# Altium project OBC Development Board.PrjPcb
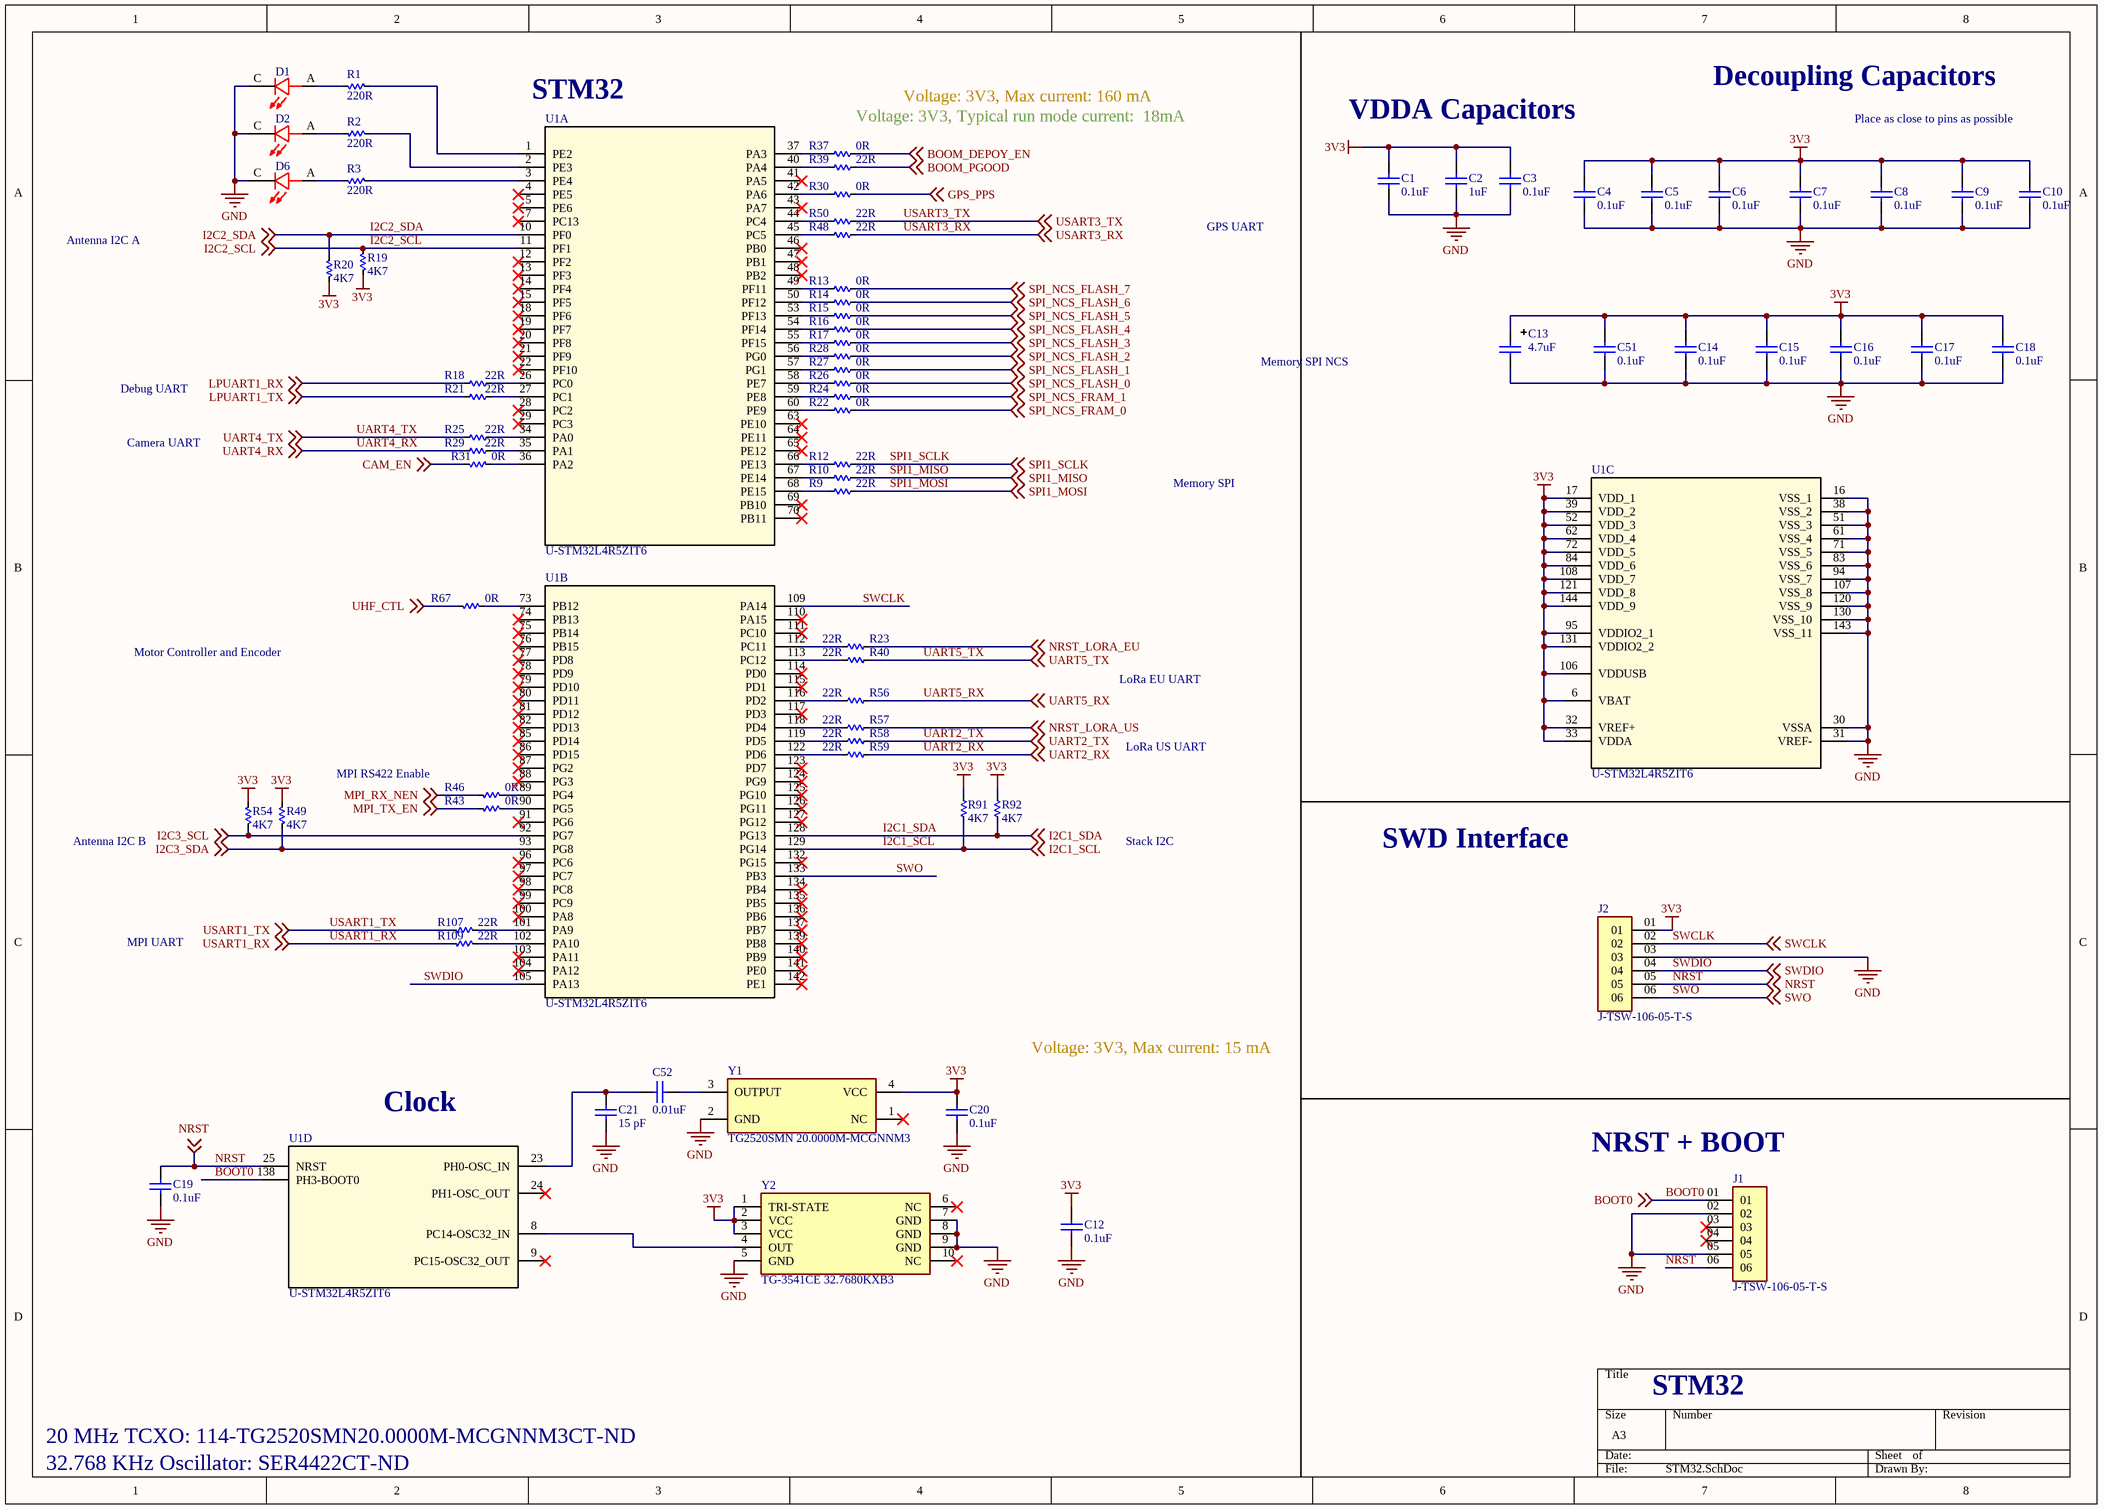
[diagram p0: STM32.SchDoc]
5 sheets, 189 parts. Net scope: global (net labels, ports and power ports of the same name join across sheets).
Board file: OBC Development Board.PcbDoc
Sheets:
  STM32.SchDoc
  Memory.SchDoc
  External Connectors.SchDoc
  Antenna and LoRa.SchDoc
  Boom Deployment.SchDoc

## Sheet STM32.SchDoc
size A3; SheetNumber: 1; SheetTotal: 5

### Parts
C1  0.1uF  [0603]
C2  1uF  [0603]
C3  0.1uF  [0603]
C4  0.1uF  [0603]
C5  0.1uF  [0603]
C6  0.1uF  [0603]
C7  0.1uF  [0603]
C8  0.1uF  [0603]
C9  0.1uF  [0603]
C10  0.1uF  [0603]
C12  0.1uF  [0402]
C13  4.7uF  [CAP TANT 1206 (A) TCJ]
C14  0.1uF  [0603]
C15  0.1uF  [0603]
C16  0.1uF  [0603]
C17  0.1uF  [0603]
C18  0.1uF  [0603]
C19  0.1uF  [0603]
C20  0.1uF  [0402]
C21  15 pF  [0402]
C51  0.1uF  [0603]
C52  0.01uF  [0603]
D1  D-SML-D12U1WT86  [D-SML-D12U1WT86]  (value not drawn)
D2  D-SML-D12U1WT86  [D-SML-D12U1WT86]  (value not drawn)
D6  D-SML-D12U1WT86  [D-SML-D12U1WT86]  (value not drawn)
J1  J-TSW-106-05-T-S  [J-TSW-106-05-T-S]
J2  J-TSW-106-05-T-S  [J-TSW-106-05-T-S]
R1  220R  [0603]
R2  220R  [0603]
R3  220R  [0603]
R9  22R  [0603]
R10  22R  [0603]
R12  22R  [0603]
R13  0R  [0603]
R14  0R  [0603]
R15  0R  [0603]
R16  0R  [0603]
R17  0R  [0603]
R18  22R  [0603]
R19  4K7  [0603]
R20  4K7  [0603]
R21  22R  [0603]
R22  0R  [0603]
R23  22R  [0603]
R24  0R  [0603]
R25  22R  [0603]
R26  0R  [0603]
R27  0R  [0603]
R28  0R  [0603]
R29  22R  [0603]
R30  0R  [0603]
R31  0R  [0603]
R37  0R  [0603]
R39  22R  [0603]
R40  22R  [0603]
R43  0R  [0603]
R46  0R  [0603]
R48  22R  [0603]
R49  4K7  [0603]
R50  22R  [0603]
R54  4K7  [0603]
R56  22R  [0603]
R57  22R  [0603]
R58  22R  [0603]
R59  22R  [0603]
R67  0R  [0603]
R91  4K7  [0603]
R92  4K7  [0603]
R107  22R  [0603]
R109  22R  [0603]
U1  U-STM32L4R5ZIT6  [U-STM32L4R5ZIT6]  (parts A,B,C,D of 4)
Y1  TG2520SMN 20.0000M-MCGNNM3  [Y-TG2520SMN 20.0000M-MCGNNM3]
Y2  TG-3541CE 32.7680KXB3  [Y-TG-3541CE 32.7680KXB3]

### Nets
3V3: C1.2 C2.2 C3.2 C4.2 C5.2 C6.2 C7.2 C8.2 C9.2 C10.2 C12.2 C13.1 C14.2 C15.2 C16.2 C17.2 C18.2 C20.2 C51.2 J2.01 R19.1 R20.1 R49.1 R54.1 R91.2 R92.1 U1.6(VBAT) U1.17(VDD_1) U1.32(VREF+) U1.33(VDDA) U1.39(VDD_2) U1.52(VDD_3) U1.62(VDD_4) U1.72(VDD_5) U1.84(VDD_6) U1.95(VDDIO2_1) U1.106(VDDUSB) U1.108(VDD_7) U1.121(VDD_8) U1.131(VDDIO2_2) U1.144(VDD_9) Y1.4(VCC) Y2.1(TRI-STATE) Y2.2(VCC) Y2.3(VCC)
GND: C1.1 C2.1 C3.1 C4.1 C5.1 C6.1 C7.1 C8.1 C9.1 C10.1 C12.1 C13.2 C14.1 C15.1 C16.1 C17.1 C18.1 C19.1 C20.1 C21.2 C51.1 D1.C D2.C D6.C J1.02 J1.05 J2.03 U1.16(VSS_1) U1.30(VSSA) U1.31(VREF-) U1.38(VSS_2) U1.51(VSS_3) U1.61(VSS_4) U1.71(VSS_5) U1.83(VSS_6) U1.94(VSS_7) U1.107(VSS_8) U1.120(VSS_9) U1.130(VSS_10) U1.143(VSS_11) Y1.2(GND) Y2.5(GND) Y2.7(GND) Y2.8(GND) Y2.9(GND)
BOOM_DEPOY_EN: R37.2 ; off-sheet BOOM_DEPOY_EN
BOOM_PGOOD: R39.1 ; off-sheet BOOM_PGOOD
BOOT0: J1.01 U1.138(PH3-BOOT0) ; off-sheet BOOT0
CAM_EN: R31.1 ; off-sheet CAM_EN
GPS_PPS: R30.2 ; off-sheet GPS_PPS
I2C1_SCL: R91.1 U1.129(PG14) ; off-sheet I2C1_SCL
I2C1_SDA: R92.2 U1.128(PG13) ; off-sheet I2C1_SDA
I2C2_SCL: R19.2 U1.11(PF1) ; off-sheet I2C2_SCL
I2C2_SDA: R20.2 U1.10(PF0) ; off-sheet I2C2_SDA
I2C3_SCL: R54.2 U1.92(PG7) ; off-sheet I2C3_SCL
I2C3_SDA: R49.2 U1.93(PG8) ; off-sheet I2C3_SDA
LPUART1_RX: R18.1 ; off-sheet LPUART1_RX
LPUART1_TX: R21.1 ; off-sheet LPUART1_TX
MPI_RX_NEN: R46.2 ; off-sheet MPI_RX_NEN
MPI_TX_EN: R43.2 ; off-sheet MPI_TX_EN
NRST: C19.2 J1.06 J2.05 U1.25(NRST) ; off-sheet NRST
NRST_LORA_EU: R23.2 ; off-sheet NRST_LORA_EU
NRST_LORA_US: R57.2 ; off-sheet NRST_LORA_US
SPI1_MISO: R10.1 ; off-sheet SPI1_MISO
SPI1_MOSI: R9.1 ; off-sheet SPI1_MOSI
SPI1_SCLK: R12.1 ; off-sheet SPI1_SCLK
SPI_NCS_FLASH_0: R26.2 ; off-sheet SPI_NCS_FLASH_0
SPI_NCS_FLASH_1: R27.2 ; off-sheet SPI_NCS_FLASH_1
SPI_NCS_FLASH_2: R28.2 ; off-sheet SPI_NCS_FLASH_2
SPI_NCS_FLASH_3: R17.2 ; off-sheet SPI_NCS_FLASH_3
SPI_NCS_FLASH_4: R16.2 ; off-sheet SPI_NCS_FLASH_4
SPI_NCS_FLASH_5: R15.2 ; off-sheet SPI_NCS_FLASH_5
SPI_NCS_FLASH_6: R14.2 ; off-sheet SPI_NCS_FLASH_6
SPI_NCS_FLASH_7: R13.2 ; off-sheet SPI_NCS_FLASH_7
SPI_NCS_FRAM_0: R22.2 ; off-sheet SPI_NCS_FRAM_0
SPI_NCS_FRAM_1: R24.2 ; off-sheet SPI_NCS_FRAM_1
SWCLK: J2.02 U1.109(PA14) ; off-sheet SWCLK
SWDIO: J2.04 U1.105(PA13) ; off-sheet SWDIO
SWO: J2.06 U1.133(PB3) ; off-sheet SWO
UART2_RX: R59.2 ; off-sheet UART2_RX
UART2_TX: R58.2 ; off-sheet UART2_TX
UART4_RX: R29.1 ; off-sheet UART4_RX
UART4_TX: R25.1 ; off-sheet UART4_TX
UART5_RX: R56.2 ; off-sheet UART5_RX
UART5_TX: R40.2 ; off-sheet UART5_TX
UHF_CTL: R67.1 ; off-sheet UHF_CTL
USART1_RX: R109.2 ; off-sheet USART1_RX
USART1_TX: R107.2 ; off-sheet USART1_TX
USART3_RX: R48.1 ; off-sheet USART3_RX
USART3_TX: R50.1 ; off-sheet USART3_TX
NetC21_1: C21.1 C52.1 U1.23(PH0-OSC_IN)
NetC52_2: C52.2 Y1.3(OUTPUT)
NetD1_A: D1.A R1.1
NetD2_A: D2.A R2.1
NetD6_A: D6.A R3.1
NetR1_2: R1.2 U1.1(PE2)
NetR2_2: R2.2 U1.2(PE3)
NetR3_2: R3.2 U1.3(PE4)
NetR9_2: R9.2 U1.68(PE15)
NetR10_2: R10.2 U1.67(PE14)
NetR12_2: R12.2 U1.66(PE13)
NetR13_1: R13.1 U1.49(PF11)
NetR14_1: R14.1 U1.50(PF12)
NetR15_1: R15.1 U1.53(PF13)
NetR16_1: R16.1 U1.54(PF14)
NetR17_1: R17.1 U1.55(PF15)
NetR18_2: R18.2 U1.26(PC0)
NetR21_2: R21.2 U1.27(PC1)
NetR22_1: R22.1 U1.60(PE9)
NetR23_1: R23.1 U1.112(PC11)
NetR24_1: R24.1 U1.59(PE8)
NetR25_2: R25.2 U1.34(PA0)
NetR26_1: R26.1 U1.58(PE7)
NetR27_1: R27.1 U1.57(PG1)
NetR28_1: R28.1 U1.56(PG0)
NetR29_2: R29.2 U1.35(PA1)
NetR30_1: R30.1 U1.42(PA6)
NetR31_2: R31.2 U1.36(PA2)
NetR37_1: R37.1 U1.37(PA3)
NetR39_2: R39.2 U1.40(PA4)
NetR40_1: R40.1 U1.113(PC12)
NetR43_1: R43.1 U1.90(PG5)
NetR46_1: R46.1 U1.89(PG4)
NetR48_2: R48.2 U1.45(PC5)
NetR50_2: R50.2 U1.44(PC4)
NetR56_1: R56.1 U1.116(PD2)
NetR57_1: R57.1 U1.118(PD4)
NetR58_1: R58.1 U1.119(PD5)
NetR59_1: R59.1 U1.122(PD6)
NetR67_2: R67.2 U1.73(PB12)
NetR107_1: R107.1 U1.101(PA9)
NetR109_1: R109.1 U1.102(PA10)
NetU1_8: U1.8(PC14-OSC32_IN) Y2.4(OUT)

Not connected (* = marked no-connect by the designer): J1 03* 04*; U1 4(PE5)* 5(PE6)* 7(PC13)* 9(PC15-OSC32_OUT)* 12(PF2)* 13(PF3)* 14(PF4)* 15(PF5)* 18(PF6)* 19(PF7)* 20(PF8)* 21(PF9)* 22(PF10)* 24(PH1-OSC_OUT)* 28(PC2)* 29(PC3)* 41(PA5)* 43(PA7)* 46(PB0)* 47(PB1)* 48(PB2)* 63(PE10)* 64(PE11)* 65(PE12)* 69(PB10)* 70(PB11)* 74(PB13)* 75(PB14)* 76(PB15)* 77(PD8)* 78(PD9)* 79(PD10)* 80(PD11)* 81(PD12)* 82(PD13)* 85(PD14)* 86(PD15)* 87(PG2)* 88(PG3)* 91(PG6)* 96(PC6)* 97(PC7)* 98(PC8)* 99(PC9)* 100(PA8)* 103(PA11)* 104(PA12)* 110(PA15)* 111(PC10)* 114(PD0)* 115(PD1)* 117(PD3)* 123(PD7)* 124(PG9)* 125(PG10)* 126(PG11)* 127(PG12)* 132(PG15)* 134(PB4)* 135(PB5)* 136(PB6)* 137(PB7)* 139(PB8)* 140(PB9)* 141(PE0)* 142(PE1)*; Y1 1(NC)*; Y2 6(NC)* 10(NC)*

### Notes on the sheet
- (near U1) STM32
- Voltage: 3V3, Max current: 160 mA
- Decoupling Capacitors
- Voltage: 3V3, Typical run mode current:  18mA
- VDDA Capacitors
- Place as close to pins as possible
- Antenna I2C A
- GPS UART
- Memory SPI NCS
- Debug UART
- Camera UART
- Memory SPI
- Motor Controller and Encoder
- LoRa EU UART
- MPI RS422 Enable
- LoRa US UART
- Antenna I2C B
- Stack I2C
- SWD Interface
- MPI UART
- Voltage: 3V3, Max current: 15 mA
- (near U1) Clock
- (near J1) NRST + BOOT
- STM32
- 20 MHz TCXO: 114-TG2520SMN20.0000M-MCGNNM3CT-ND
- 32.768 KHz Oscillator: SER4422CT-ND

### Library data of the parts
C1 C3-C10 C14-C19 C51 = CC-104-K-25V-X7R-0603: 0.1 µF ±10% 25V Ceramic Capacitor X7R 0603 (1608 Metric); Manufacturer: Samsung Electro-Mechanics; Manufacturer Part #: CL10B104KA8NNNC; ComponentLink1description: Datasheet; ComponentLink1URL: https://ds.yuden.co.jp/TYCOMPAS/ut/detail?pn=TMK105BJ104KV-F%20%20&u=M; ComponentLink2description: Manufacturer Website; Distributor: Digikey; Distributor Part #: 1276-1006-1-ND; Part Description: 0.1 µF ±10% 25V Ceramic Capacitor X7R 0603 (1608 Metric); ComponentLink2URL: https://www.yuden.co.jp/or/; Value: 0.1uF
C2 = CC-105-K-25V-X7R-0603: CAP CER 1UF 25V X7R 0603; Manufacturer: Yageo; Manufacturer Part #: CC0603KRX7R8BB105; ComponentLink1Description: Datasheet; ComponentLink1URL: https://www.yageo.com/upload/media/product/productsearch/datasheet/mlcc/UPY-GPHC_X7R_6.3V-to-50V_18.pdf; ComponentLink2Description: Manufacture Website; ComponentLink2URL: https://www.yageo.com/en/Home; Distributor: Digikey; Distributor Part #: 311-1802-1-ND; Part Description: CAP CER 1UF 25V X7R 0603; SignalCraft Part #: CC-105-K-25V-X7R-0603; Value: 1uF
C12 C20 = CC-104-K-25V-X7R-0402: CAP CER 0.1UF 25V X7R 0402; Manufacturer: YAGEO; Manufacturer Part #: CC0402KPX7R8BB104; ComponentLink1description: Datasheet; ComponentLink1URL: https://ds.yuden.co.jp/TYCOMPAS/ut/detail?pn=TMK105BJ104KV-F%20%20&u=M; ComponentLink2description: Manufacturer Website; Distributor: Digikey; Distributor Part #: 13-CC0402KPX7R8BB104CT-ND; Part Description: CAP CER 0.1UF 25V X7R 0402; ComponentLink2URL: https://www.yuden.co.jp/or/; Value: 0.1uF
C13 = CT-474-M-20V-OTH-1206: 4.7 µF Molded Tantalum Capacitors 20 V 1206 (3216 Metric) 4Ohm; Manufacturer: AVX Corporation; Manufacturer Part #: TAJA475K020RNJ; ComponentLink1Description: Datasheet; ComponentLink1URL: *; ComponentLink2Description: Manufacturer Website; ComponentLink2URL: *; Distributor: Digikey; Distributor Part #: 478-1668-1-ND; Part Description: 4.7 µF Molded Tantalum Capacitors 20 V 1206 (3216 Metric) 4Ohm; Value: 4.7uF
C21 = CC-159-J-50V-C0G-0402: 15 pF ±1% 50V Ceramic Capacitor C0G, NP0 0402 (1005 Metric); Manufacturer: YAGEO; Manufacturer Part #: CC0402FRNPO9BN150; ComponentLink1Description: Datasheet; ComponentLink1URL: *; ComponentLink2Description: Manufacture Website; ComponentLink2URL: *; Distributor: Digikey; Distributor Part #: 311-1642-1-ND; Part Description: 15 pF ±1% 50V Ceramic Capacitor C0G, NP0 0402 (1005 Metric); Value: 15 pF
C52 = CC-105-K-50V-X7R-0603: CAP CER 10000PF 50V X7R 0603; Manufacturer: Samsung Electro-Mechanics; Manufacturer Part #: CL10B103KB8NNNC; ComponentLink1description: Datasheet; ComponentLink1URL: https://ds.yuden.co.jp/TYCOMPAS/ut/detail?pn=TMK105BJ104KV-F%20%20&u=M; ComponentLink2description: Manufacturer Website; Distributor: Digikey; Distributor Part #: 1276-1009-1-ND; Part Description: CAP CER 10000PF 50V X7R 0603; ComponentLink2URL: https://www.yuden.co.jp/or/; Value: 0.01uF
D1 D2 D6 = D-SML-D12U1WT86: Red 620nm LED Indication - Discrete 2.2V 0603 _1608 Metric; Manufacturer: Rohm Semiconductor; Manufacturer Part #: SML-D12U1WT86; Distributor: Digikey; Distributor Part #: SML-D12U1WT86CT-ND
J1 J2 = J-TSW-106-05-T-S: CONN HEADER VERT 6POS 2.54MM; Distrbutor part #: SAM12323-ND; Manufacturer: Samtec; Distrbutor: None; Manufacturer Part #: TSW-106-05-T-S; Price: None
R1-R3 = RT-220R-F-1/16W-0603: 220 Ohms ±0.5% 0.063W, 1/16W Chip Resistor 0603 (1608 Metric) - Thin Film; Manufacturer: Susumu; Manufacturer Part #: RR0816P-221-D; Distributor: Digikey; Distributor Part #: RR08P220DCT-ND; Part Description: 220 Ohms ±0.5% 0.063W, 1/16W Chip Resistor 0603 (1608 Metric) - Thin Film; Value: 220R
R9 R10 R12 R18 R21 R23 R25 R29 R39 R40 R48 R50 R56-R59 R107 R109 = RT-22R0-F-1/16W-0603: 22 Ohms ±0.5% 0.063W, 1/16W Chip Resistor 0603 (1608 Metric) - Thin Film; Manufacturer: Susumu; Manufacturer Part #: RR0816Q-220-D; ComponentLink1description: Datasheet; ComponentLink1URL: https://www.vishay.com/docs/20035/dcrcwe3.pdf; ComponentLink2description: Manufacturer Website; Distributor: Digikey; Distributor Part #: RR08Q22DCT-ND; Part Description: 22 Ohms ±0.5% 0.063W, 1/16W Chip Resistor 0603 (1608 Metric) - Thin Film; ComponentLink2URL: https://www.vishay.com/; Value: 22R
R13-R17 R22 R24 R26-R28 R30 R31 R37 R43 R46 R67 = RT-0R00-F-1/10W-0603: 0 Ohms Jumper 0.1W, 1/10W Chip Resistor 0603 (1608 Metric) Automotive AEC-Q200 Thick Film; Manufacturer: Stackpole Electronics Inc; Manufacturer Part #: RMCF0603ZT0R00; ComponentLink1description: Datasheet; ComponentLink1URL: https://industrial.panasonic.com/ww/products/resistors/chip-resistors/general-purpose-chip-resistors/models/ERJ2GE0R00X; ComponentLink2description: Manufacturer Website; Distributor: Digikey; Distributor Part #: RMCF0603ZT0R00CT-ND; Part Description: 0 Ohms Jumper 0.1W, 1/10W Chip Resistor 0603 (1608 Metric) Automotive AEC-Q200 Thick Film; ComponentLink2URL: https://industrial.panasonic.com/ww/products/resistors/chip-resistors/general-purpose-chip-resistors/models/ERJ2GE0R00X; Value: 0R
R19 R20 R49 R54 R91 R92 = RT-4K7-F-1/16W-0603: RES SMD 4.7K OHM 1% 1/10W 0603; Manufacturer: Bourns Inc.; Manufacturer Part #: CR0603-FX-4701ELF; ComponentLink1description: Datasheet; ComponentLink1URL: https://www.vishay.com/docs/20035/dcrcwe3.pdf; ComponentLink2description: Manufacturer Website; Distributor: Digikey; Distributor Part #: CR0603-FX-4701ELFCT-ND; Part Description: RES SMD 4.7K OHM 1% 1/10W 0603; ComponentLink2URL: https://www.vishay.com/; Value: 4K7
U1 = U-STM32L4R5ZIT6: IC MCU 32BIT 2MB FLASH 144LQFP; Manufacturer: STMicroelectronics; Distributor: Mouser; Manufacturer Part #: STM32L4R5ZIT6; Mouser Part Number: 511-STM32L4R5ZIT6P
Y1 = Y-TG2520SMN 20.0000M-MCGNNM3: XTAL OSC TCXO 20.0000MHZ CSWV; Manufacturer: EPSON; Manufacturer Part #: TG2520SMN 20.0000M-MCGNNM3; Distributor: Digikey; Distributor Part #: 114-TG2520SMN20.0000M-MCGNNM3CT-ND
Y2 = Y-TG-3541CE 32.7680KXB3: XTAL OSC TCXO 32.7680KHZ CMOS; Manufacturer: EPSON; Manufacturer Part #: TG-3541CE 32.7680KXB3; Distributor: Digikey; Distributor Part #: SER4422CT-ND

## Sheet Memory.SchDoc: Microcontroller
size A3; DrawnBy: James Chen; Revision: 1.0; SheetNumber: 2; SheetTotal: 5
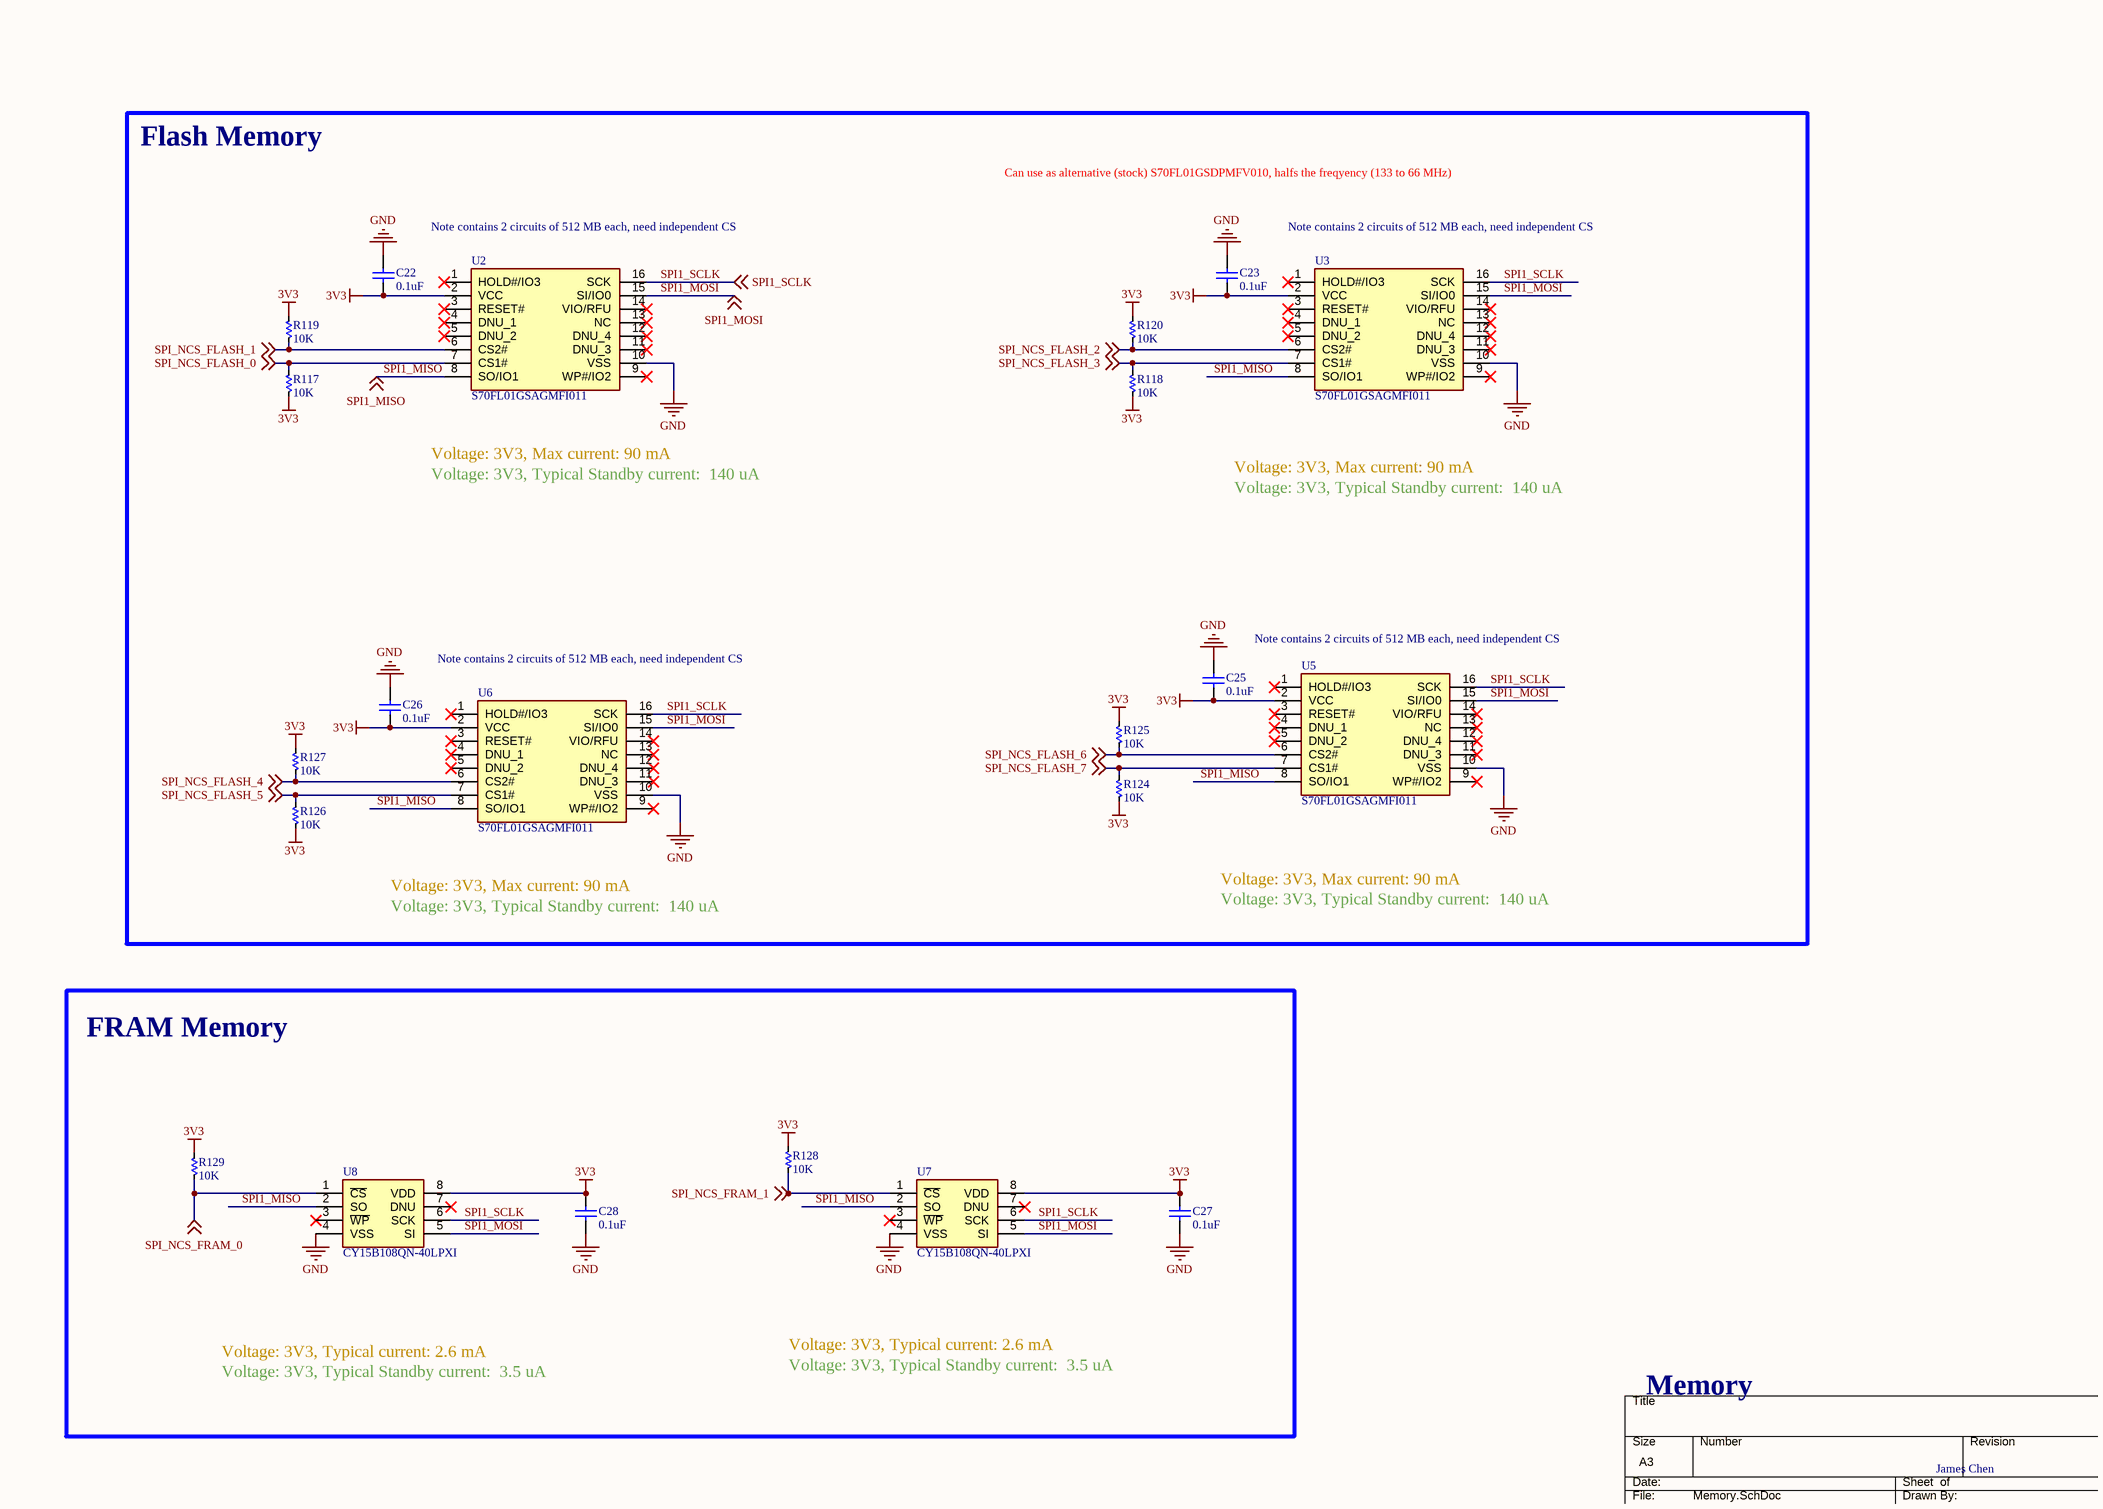
[diagram p1: Memory.SchDoc]

### Parts
C22  0.1uF  [0603]
C23  0.1uF  [0603]
C25  0.1uF  [0603]
C26  0.1uF  [0603]
C27  0.1uF  [0603]
C28  0.1uF  [0603]
R117  10K  [0603]
R118  10K  [0603]
R119  10K  [0603]
R120  10K  [0603]
R124  10K  [0603]
R125  10K  [0603]
R126  10K  [0603]
R127  10K  [0603]
R128  10K  [0603]
R129  10K  [0603]
U2  S70FL01GSAGMFI011  [U-S70FL01GSAGMFI011]
U3  S70FL01GSAGMFI011  [U-S70FL01GSAGMFI011]
U5  S70FL01GSAGMFI011  [U-S70FL01GSAGMFI011]
U6  S70FL01GSAGMFI011  [U-S70FL01GSAGMFI011]
U7  CY15B108QN-40LPXI  [U-CY15B108QN-40LPXI]
U8  CY15B108QN-40LPXI  [U-CY15B108QN-40LPXI]

### Blocks framed on the sheet
Flash Memory: C22 C23 C25 C26 R117-R120 R124-R127 U2 U3 U5 U6
FRAM Memory: C27 C28 R128 R129 U7 U8

### Nets
3V3: C22.1 C23.1 C25.1 C26.1 C27.1 C28.1 R117.1 R118.1 R119.1 R120.2 R124.1 R125.2 R126.1 R127.2 R128.1 R129.1 U2.2(VCC) U3.2(VCC) U5.2(VCC) U6.2(VCC) U7.8(VDD) U8.8(VDD)
GND: C22.2 C23.2 C25.2 C26.2 C27.2 C28.2 U2.10(VSS) U3.10(VSS) U5.10(VSS) U6.10(VSS) U7.4(VSS) U8.4(VSS)
SPI1_MISO: U2.8(SO/IO1) U3.8(SO/IO1) U5.8(SO/IO1) U6.8(SO/IO1) U7.2(SO) U8.2(SO) ; off-sheet SPI1_MISO
SPI1_MOSI: U2.15(SI/IO0) U3.15(SI/IO0) U5.15(SI/IO0) U6.15(SI/IO0) U7.5(SI) U8.5(SI) ; off-sheet SPI1_MOSI
SPI1_SCLK: U2.16(SCK) U3.16(SCK) U5.16(SCK) U6.16(SCK) U7.6(SCK) U8.6(SCK) ; off-sheet SPI1_SCLK
SPI_NCS_FLASH_0: R117.2 U2.7(CS1#) ; off-sheet SPI_NCS_FLASH_0
SPI_NCS_FLASH_1: R119.2 U2.6(CS2#) ; off-sheet SPI_NCS_FLASH_1
SPI_NCS_FLASH_2: R120.1 U3.6(CS2#) ; off-sheet SPI_NCS_FLASH_2
SPI_NCS_FLASH_3: R118.2 U3.7(CS1#) ; off-sheet SPI_NCS_FLASH_3
SPI_NCS_FLASH_4: R127.1 U6.6(CS2#) ; off-sheet SPI_NCS_FLASH_4
SPI_NCS_FLASH_5: R126.2 U6.7(CS1#) ; off-sheet SPI_NCS_FLASH_5
SPI_NCS_FLASH_6: R125.1 U5.6(CS2#) ; off-sheet SPI_NCS_FLASH_6
SPI_NCS_FLASH_7: R124.2 U5.7(CS1#) ; off-sheet SPI_NCS_FLASH_7
SPI_NCS_FRAM_0: R129.2 U8.1(~{CS}) ; off-sheet SPI_NCS_FRAM_0
SPI_NCS_FRAM_1: R128.2 U7.1(~{CS}) ; off-sheet SPI_NCS_FRAM_1

Not connected (* = marked no-connect by the designer): U2 1(HOLD#/IO3)* 3(RESET#)* 4(DNU_1)* 5(DNU_2)* 9(WP#/IO2)* 11(DNU_3)* 12(DNU_4)* 13(NC)* 14(VIO/RFU)*; U3 1(HOLD#/IO3)* 3(RESET#)* 4(DNU_1)* 5(DNU_2)* 9(WP#/IO2)* 11(DNU_3)* 12(DNU_4)* 13(NC)* 14(VIO/RFU)*; U5 1(HOLD#/IO3)* 3(RESET#)* 4(DNU_1)* 5(DNU_2)* 9(WP#/IO2)* 11(DNU_3)* 12(DNU_4)* 13(NC)* 14(VIO/RFU)*; U6 1(HOLD#/IO3)* 3(RESET#)* 4(DNU_1)* 5(DNU_2)* 9(WP#/IO2)* 11(DNU_3)* 12(DNU_4)* 13(NC)* 14(VIO/RFU)*; U7 3(~{WP})* 7(DNU)*; U8 3(~{WP})* 7(DNU)*

### Notes on the sheet
- Can use as alternative (stock) S70FL01GSDPMFV010, halfs the freqyency (133 to 66 MHz)
- Note contains 2 circuits of 512 MB each, need independent CS
- Voltage: 3V3, Max current: 90 mA
- Voltage: 3V3, Typical Standby current:  140 uA
- Voltage: 3V3, Typical current: 2.6 mA
- Voltage: 3V3, Typical Standby current:  3.5 uA
- Memory
- James Chen
- DWG NO:
- REV:
- THIS DOCUMENT AND THE DATA DISCLOSED HEREIN OR
- HEREWITH IS THE PROPERTY OF ALTIUM LIMITED AND MAY
- BE FREELY DISTRIBUTED IN WHOLE. NO RIGHTS ARE
- RESERVED OR EXPRESS OR IMPLIED WARANTEE GIVEN.
- REVISION
- DESCRIPTION
- DATE
- APPROVED
- ENG:
- APPROVALS
- PROJECT
- DSN:
- CHK:
- REFERENCE DOCUMENTS
- PROJECT REVISION:
- TITLE
- DOCUMENT REVISION:
- DESIGN ITEM:
- BOM:
- FAB DWG:
- PCB DWG:
- ASSY DWG:
- SCALE:
- A2
- SIZE
- CAGE CODE
- FILE NAME
- DWG NO.
- SHEET
- OF
- REV

### Library data of the parts
C22 C23 C25-C28 = CC-104-K-25V-X7R-0603: as C1 on sheet STM32; ComponentLink1description: Datasheet; ComponentLink1URL: https://ds.yuden.co.jp/TYCOMPAS/ut/detail?pn=TMK105BJ104KV-F%20%20&u=M; ComponentLink2description: Manufacturer Website; Distributor: Digikey; Distributor Part #: 1276-1006-1-ND; Part Description: 0.1 µF ±10% 25V Ceramic Capacitor X7R 0603 (1608 Metric); ComponentLink2URL: https://www.yuden.co.jp/or/; Value: 0.1uF
R117-R120 R124-R129 = RT-10K0-F-1/16W-0603: 10 kOhms ±0.1% 0.063W, 1/16W Chip Resistor 0603 (1608 Metric) - Thin Film; Manufacturer: TE Connectivity Passive Product; Manufacturer Part #: CPF0603B10KE; ComponentLink1description: Datasheet; ComponentLink1URL: https://www.vishay.com/docs/20035/dcrcwe3.pdf; ComponentLink2description: Manufacturer Website; Distributor: Digikey; Distributor Part #: A119886CT-ND; Part Description: 10 kOhms ±0.1% 0.063W, 1/16W Chip Resistor 0603 (1608 Metric) - Thin Film; ComponentLink2URL: https://www.vishay.com/; Value: 10K
U2 U3 U5 U6 = U-S70FL01GSAGMFI011: IC FLASH 1GBIT SPI/QUAD 16SOIC; Manufacturer: Cypress Semiconductor; Distributor: Digikey; Distributor Part #: 1274-1092-ND; Manufacturer Part #: S70FL01GSAGMFI011
U7 U8 = U-CY15B108QN-40LPXI: IC FRAM 8MBIT SPI 40MHZ 8GQFN; Manufacturer: Cypress Semiconductor; Manufacturer Part #: CY15B108QN-40LPXI; Distributor: Digikey; Distributor Part #: 428-4723-ND

## Sheet External Connectors.SchDoc
size A3; SheetNumber: 3; SheetTotal: 5
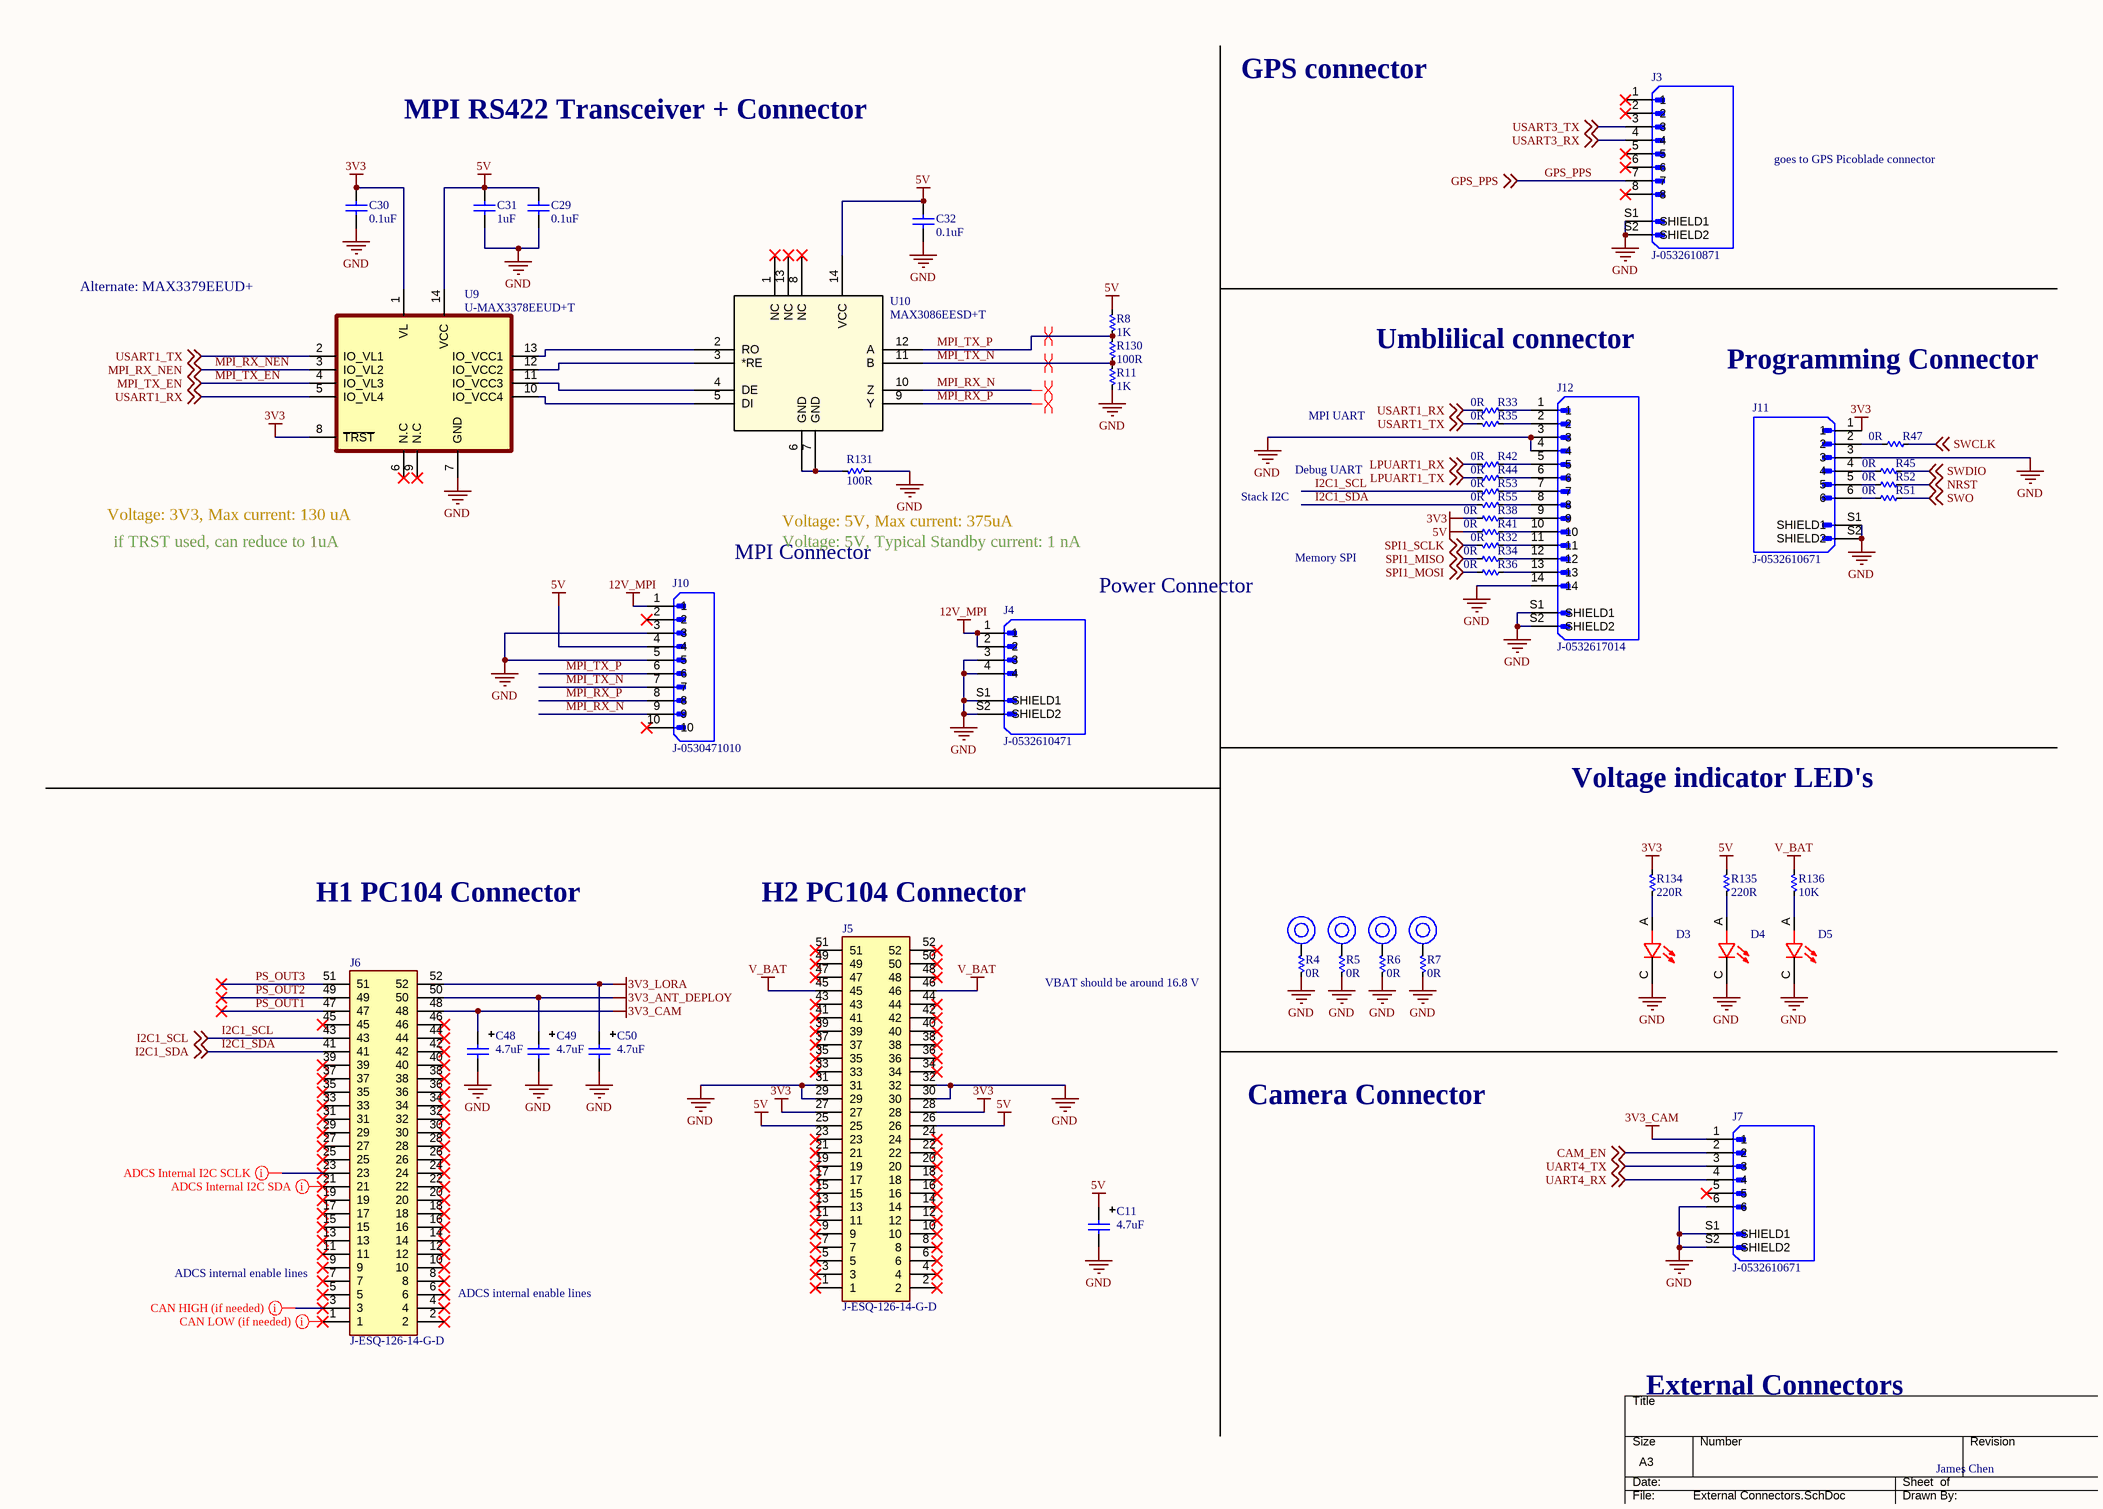
[diagram p2: External Connectors.SchDoc]

### Parts
*1  PC104 Mounting  [PC104 Mounting Points]  (value not drawn)
*2  PC104 Mounting  [PC104 Mounting Points]  (value not drawn)
*3  PC104 Mounting  [PC104 Mounting Points]  (value not drawn)
*4  PC104 Mounting  [PC104 Mounting Points]  (value not drawn)
C11  4.7uF  [CAP TANT 1206 (A) TCJ]
C29  0.1uF  [0603]
C30  0.1uF  [0603]
C31  1uF  [0603]
C32  0.1uF  [0603]
C48  4.7uF  [CAP TANT 1206 (A) TCJ]
C49  4.7uF  [CAP TANT 1206 (A) TCJ]
C50  4.7uF  [CAP TANT 1206 (A) TCJ]
D3  D-SML-D12U1WT86  [D-SML-D12U1WT86]  (value not drawn)
D4  D-SML-D12U1WT86  [D-SML-D12U1WT86]  (value not drawn)
D5  D-SML-D12U1WT86  [D-SML-D12U1WT86]  (value not drawn)
J3  J-0532610871  [J-532610871]
J4  J-0532610471  [J-53261-0471]
J5  J-ESQ-126-14-G-D  [J-ESQ-126-14-G-D]
J6  J-ESQ-126-14-G-D  [J-ESQ-126-14-G-D]
J7  J-0532610671  [J-0532610671]
J10  J-0530471010  [J-0530471010]
J11  J-0532610671  [J-0532610671]
J12  J-0532617014  [J-532617014]
R4  0R  [0603]
R5  0R  [0603]
R6  0R  [0603]
R7  0R  [0603]
R8  1K  [0603]
R11  1K  [0603]
R32  0R  [0603]
R33  0R  [0603]
R34  0R  [0603]
R35  0R  [0603]
R36  0R  [0603]
R38  0R  [0603]
R41  0R  [0603]
R42  0R  [0603]
R44  0R  [0603]
R45  0R  [0603]
R47  0R  [0603]
R51  0R  [0603]
R52  0R  [0603]
R53  0R  [0603]
R55  0R  [0603]
R130  100R  [0603]
R131  100R  [0603]
R134  value 220R  [0402]  (hidden comment: 100R)
R135  value 220R  [0402]  (hidden comment: 100R)
R136  10K  [0603]
U9  U-MAX3378EEUD+T  [U-MAX3378EEUD+T]
U10  MAX3086EESD+T  [U-MAX3086EESD+T]

### Nets
3V3: C30.1 J5.27 J5.28 J11.1 R38.2 R134.1 U9.1(VL) U9.8(~{TRST})
3V3_ANT_DEPLOY: C49.1 J6.50
3V3_CAM: C48.1 J6.48 J7.1
3V3_LORA: C50.1 J6.52
5V: C11.1 C29.1 C31.2 C32.1 J5.25 J5.26 J10.4 R8.2 R41.2 R135.1 U9.14(VCC) U10.14(VCC)
12V_MPI: J4.1 J4.2 J10.1
GND: C11.2 C29.2 C30.2 C31.1 C32.2 C48.2 C49.2 C50.2 D3.C D4.C D5.C J3.S1(SHIELD1) J3.S2(SHIELD2) J4.3 J4.4 J4.S1(SHIELD1) J4.S2(SHIELD2) J5.29 J5.30 J5.31 J5.32 J7.6 J7.S1(SHIELD1) J7.S2(SHIELD2) J10.3 J10.5 J11.3 J11.S1(SHIELD1) J11.S2(SHIELD2) J12.3 J12.4 J12.14 J12.S1(SHIELD1) J12.S2(SHIELD2) R4.1 R5.1 R6.1 R7.1 R11.1 R131.1 U9.7(GND)
V_BAT: J5.45 J5.46 R136.2
CAM_EN: J7.2 ; off-sheet CAM_EN
GPS_PPS: J3.7 ; off-sheet GPS_PPS
I2C1_SCL: J6.43 R53.1 ; off-sheet I2C1_SCL
I2C1_SDA: J6.41 R55.1 ; off-sheet I2C1_SDA
LPUART1_RX: R42.1 ; off-sheet LPUART1_RX
LPUART1_TX: R44.1 ; off-sheet LPUART1_TX
MPI_RX_N: J10.9 U10.10(Z)
MPI_RX_NEN: U9.3(IO_VL2) ; off-sheet MPI_RX_NEN
MPI_RX_P: J10.8 U10.9(Y)
MPI_TX_EN: U9.4(IO_VL3) ; off-sheet MPI_TX_EN
MPI_TX_N: J10.7 R11.2 R130.1 U10.11(B)
MPI_TX_P: J10.6 R8.1 R130.2 U10.12(A)
NRST: R52.1 ; off-sheet NRST
PS_OUT1: J6.47
PS_OUT2: J6.49
PS_OUT3: J6.51
SPI1_MISO: R34.2 ; off-sheet SPI1_MISO
SPI1_MOSI: R36.2 ; off-sheet SPI1_MOSI
SPI1_SCLK: R32.1 ; off-sheet SPI1_SCLK
SWCLK: R47.1 ; off-sheet SWCLK
SWDIO: R45.1 ; off-sheet SWDIO
SWO: R51.1 ; off-sheet SWO
UART4_RX: J7.4 ; off-sheet UART4_RX
UART4_TX: J7.3 ; off-sheet UART4_TX
USART1_RX: R33.1 U9.5(IO_VL4) ; off-sheet USART1_RX
USART1_TX: R35.1 U9.2(IO_VL1) ; off-sheet USART1_TX
USART3_RX: J3.4 ; off-sheet USART3_RX
USART3_TX: J3.3 ; off-sheet USART3_TX
Net*1_1: *1.1 R4.2
Net*2_1: *2.1 R5.2
Net*3_1: *3.1 R6.2
Net*4_1: *4.1 R7.2
NetD3_A: D3.A R134.2
NetD4_A: D4.A R135.2
NetD5_A: D5.A R136.1
NetJ11_2: J11.2 R47.2
NetJ11_4: J11.4 R45.2
NetJ11_5: J11.5 R52.2
NetJ11_6: J11.6 R51.2
NetJ12_1: J12.1 R33.2
NetJ12_2: J12.2 R35.2
NetJ12_5: J12.5 R42.2
NetJ12_6: J12.6 R44.2
NetJ12_7: J12.7 R53.2
NetJ12_8: J12.8 R55.2
NetJ12_9: J12.9 R38.1
NetJ12_10: J12.10 R41.1
NetJ12_11: J12.11 R32.2
NetJ12_12: J12.12 R34.1
NetJ12_13: J12.13 R36.1
NetR131_2: R131.2 U10.6(GND) U10.7(GND)
NetU9_10: U9.10(IO_VCC4) U10.5(DI)
NetU9_11: U9.11(IO_VCC3) U10.4(DE)
NetU9_12: U9.12(IO_VCC2) U10.3(*RE)
NetU9_13: U9.13(IO_VCC1) U10.2(RO)

Not connected (* = marked no-connect by the designer): J3 1* 2* 5* 6* 8*; J5 1* 2* 3* 4* 5* 6* 7* 8* 9* 10* 11* 12* 13* 14* 15* 16* 17* 18* 19* 20* 21* 22* 23* 24* 33* 34* 35* 36* 37* 38* 39* 40* 41* 42* 43* 44* 47* 48* 49* 50* 51* 52*; J6 1* 2* 3* 4* 5* 6* 7* 8* 9* 10* 11* 12* 13* 14* 15* 16* 17* 18* 19* 20* 21* 22* 23* 24* 25* 26* 27* 28* 29* 30* 31* 32* 33* 34* 35* 36* 37* 38* 39* 40* 42* 44* 45* 46*; J7 5*; J10 2* 10*; U9 6(N.C)* 9(N.C)*; U10 1(NC)* 8(NC)* 13(NC)*

### Layout directives
mark named CAN LOW (if needed): NetJ6_1
mark named CAN HIGH (if needed): NetJ6_3
mark named ADCS Internal I2C SDA: NetJ6_21
mark named ADCS Internal I2C SCLK: NetJ6_23
differential pair; net class DIF 100 OHMS: MPI_RX_N, MPI_RX_P, MPI_TX_N, MPI_TX_P

### Notes on the sheet
- GPS connector
- MPI RS422 Transceiver + Connector
- goes to GPS Picoblade connector
- Alternate: MAX3379EEUD+
- Umblilical connector
- Programming Connector
- MPI UART
- Stack I2C
- Debug UART
- Voltage: 3V3, Max current: 130 uA
- if TRST used, can reduce to 1uA
- (near J10) MPI Connector
- (near R131) Voltage: 5V, Max current: 375uA
- Voltage: 5V, Typical Standby current: 1 nA
- Memory SPI
- (near J4) Power Connector
- Voltage indicator LED's
- H1 PC104 Connector
- (near J5) H2 PC104 Connector
- VBAT should be around 16.8 V
- Camera Connector
- (near J6) ADCS internal enable lines
- External Connectors
- James Chen
- THIS DOCUMENT AND THE DATA DISCLOSED HEREIN OR
- HEREWITH IS THE PROPERTY OF ALTIUM LIMITED AND MAY
- DWG NO:
- REVISION
- REV:
- DESCRIPTION
- DATE
- APPROVED
- BE FREELY DISTRIBUTED IN WHOLE. NO RIGHTS ARE
- RESERVED OR EXPRESS OR IMPLIED WARANTEE GIVEN.
- ENG:
- APPROVALS
- PROJECT
- DSN:
- CHK:
- REFERENCE DOCUMENTS
- PROJECT REVISION:
- TITLE
- DOCUMENT REVISION:
- DESIGN ITEM:
- BOM:
- FAB DWG:
- PCB DWG:
- ASSY DWG:
- SCALE:
- A3
- SIZE
- CAGE CODE
- FILE NAME
- DWG NO.
- SHEET
- OF
- REV

### Library data of the parts
C11 C48-C50 = CT-474-M-20V-OTH-1206: as C13 on sheet STM32; ComponentLink1Description: Datasheet; ComponentLink1URL: *; ComponentLink2Description: Manufacturer Website; ComponentLink2URL: *; Distributor: Digikey; Distributor Part #: 478-1668-1-ND; Part Description: 4.7 µF Molded Tantalum Capacitors 20 V 1206 (3216 Metric) 4Ohm; Value: 4.7uF
C29 C30 C32 = CC-104-K-25V-X7R-0603: as C1 on sheet STM32; ComponentLink1description: Datasheet; ComponentLink1URL: https://ds.yuden.co.jp/TYCOMPAS/ut/detail?pn=TMK105BJ104KV-F%20%20&u=M; ComponentLink2description: Manufacturer Website; Distributor: Digikey; Distributor Part #: 1276-1006-1-ND; Part Description: 0.1 µF ±10% 25V Ceramic Capacitor X7R 0603 (1608 Metric); ComponentLink2URL: https://www.yuden.co.jp/or/; Value: 0.1uF
C31 = CC-105-K-25V-X7R-0603: as C2 on sheet STM32; ComponentLink1Description: Datasheet; ComponentLink1URL: https://www.yageo.com/upload/media/product/productsearch/datasheet/mlcc/UPY-GPHC_X7R_6.3V-to-50V_18.pdf; ComponentLink2Description: Manufacture Website; ComponentLink2URL: https://www.yageo.com/en/Home; Distributor: Digikey; Distributor Part #: 311-1802-1-ND; Part Description: CAP CER 1UF 25V X7R 0603; SignalCraft Part #: CC-105-K-25V-X7R-0603; Value: 1uF
D3-D5 = D-SML-D12U1WT86: as D1 on sheet STM32; Manufacturer Part #: SML-D12U1WT86; Distributor: Digikey; Distributor Part #: SML-D12U1WT86CT-ND
J3 = J-0532610871: CONN HEADER SMD R/A 8POS 1.25MM; Manfacturer: Molex; Manfacturer Part #: 0532610871; Distributor Part #: WM7626CT-ND; Distributor: Digi-Key
J4 = J-0532610471: CONN HEADER SMD R/A 4POS 1.25MM; Manfacturer: Molex; Manfacturer Part #: 0532610471; Distributor Part #: WM7622CT-ND; Distributor: Digi-Key
J5 J6 = J-ESQ-126-14-G-D: CONN SOCKET 52POS 0.1 GOLD PCB; Manufacturer: Samtec Inc.; Manufacturer Part #: ESQ-126-14-G-D; Distributor: Digikey; Distributor Part #: SAM11114-ND
J7 J11 = J-0532610671: CONN HEADER SMD R/A 6POS 1.25MM; Manfacturer: Molex; Distributor: Digi-Key; Manfacturer Part #: 0532610671; Distributor Part #: WM7624CT-ND
J10 = J-0530471010: CONN HEADER VERT 10POS 1.25MM; Manufacturer: Molex; Manufacturer Part #: 0530471010; Distributor: Digikey; Distributor Part #: WM1739-ND
J12 = J-0532617014: Connector Header Surface Mount, Right Angle 14 position 0.049 (1.25mm); Manufacturer: Molex; Manufacturer Part #: 0532617014; Distributor: Digikey; Distributor Part #: 900-0532617014CT-ND; SnapEDA_Link: https://www.snapeda.com/parts/532617014/Molex/view-part/5064407/?ref=snap
R4-R7 R32-R36 R38 R41 R42 R44 R45 R47 R51-R53 R55 = RT-0R00-F-1/10W-0603: as R13 on sheet STM32; ComponentLink1description: Datasheet; ComponentLink1URL: https://industrial.panasonic.com/ww/products/resistors/chip-resistors/general-purpose-chip-resistors/models/ERJ2GE0R00X; ComponentLink2description: Manufacturer Website; Distributor: Digikey; Distributor Part #: RMCF0603ZT0R00CT-ND; Part Description: 0 Ohms Jumper 0.1W, 1/10W Chip Resistor 0603 (1608 Metric) Automotive AEC-Q200 Thick Film; ComponentLink2URL: https://industrial.panasonic.com/ww/products/resistors/chip-resistors/general-purpose-chip-resistors/models/ERJ2GE0R00X; Value: 0R
R8 R11 = RT-1K0-F-1/16W-0603: RES SMD 1K OHM 1% 1/16W 0603; Manufacturer: TE Connectivity Passive Product; Manufacturer Part #: CPF0603F1K0C1; ComponentLink1description: Datasheet; ComponentLink1URL: https://www.vishay.com/docs/20035/dcrcwe3.pdf; ComponentLink2description: Manufacturer Website; Distributor: Digikey; Distributor Part #: A102226CT-ND; Part Description: RES SMD 1K OHM 1% 1/16W 0603; ComponentLink2URL: https://www.vishay.com/; Value: 1K
R130 R131 = RT-100R-F-1/16W-0603: RES SMD 100 OHM 0.5% 1/16W 0603; Manufacturer: Susumu; Manufacturer Part #: RR08P100DCT-ND; Distributor: Digikey; Distributor Part #: RR08P100DCT-ND; Part Description: RES SMD 100 OHM 0.5% 1/16W 0603; Value: 100R
R134 R135 = RT-220R-F-1/16W-0402: RES 220 OHM 5% 1/16W 0402; Manufacturer: Yageo; Manufacturer Part #: RC0402JR-07220RL; Distributor: Digikey; Distributor Part #: 311-220JRCT-ND; Part Description: RES 220 OHM 5% 1/16W 0402
R136 = RT-10K0-F-1/16W-0603: as R117 on sheet Memory; ComponentLink1description: Datasheet; ComponentLink1URL: https://www.vishay.com/docs/20035/dcrcwe3.pdf; ComponentLink2description: Manufacturer Website; Distributor: Digikey; Distributor Part #: A119886CT-ND; Part Description: 10 kOhms ±0.1% 0.063W, 1/16W Chip Resistor 0603 (1608 Metric) - Thin Film; ComponentLink2URL: https://www.vishay.com/; Value: 10K
U9 = U-MAX3378EEUD+T: IC TRNSLTR BIDIRECTIONAL 14TSSOP; Manufacturer: Maxim Integrated; Manufacturer Part #: MAX3378EEUD+T; Distributor: Digikey; Distributor Part #: MAX3378EEUD+TCT-ND
U10 = U-MAX3086EESD+T: IC TRANSCEIVER FULL 1/1 14SOIC; Manufacturer: Maxim Integrated Products; Manufacturer Part #: MAX3086EESD+T; Distributor: Digikey; Distributor Part #: MAX3086EESD+TCT-ND; Type: DEV

## Sheet Antenna and LoRa.SchDoc
size A3; SheetNumber: 4; SheetTotal: 5
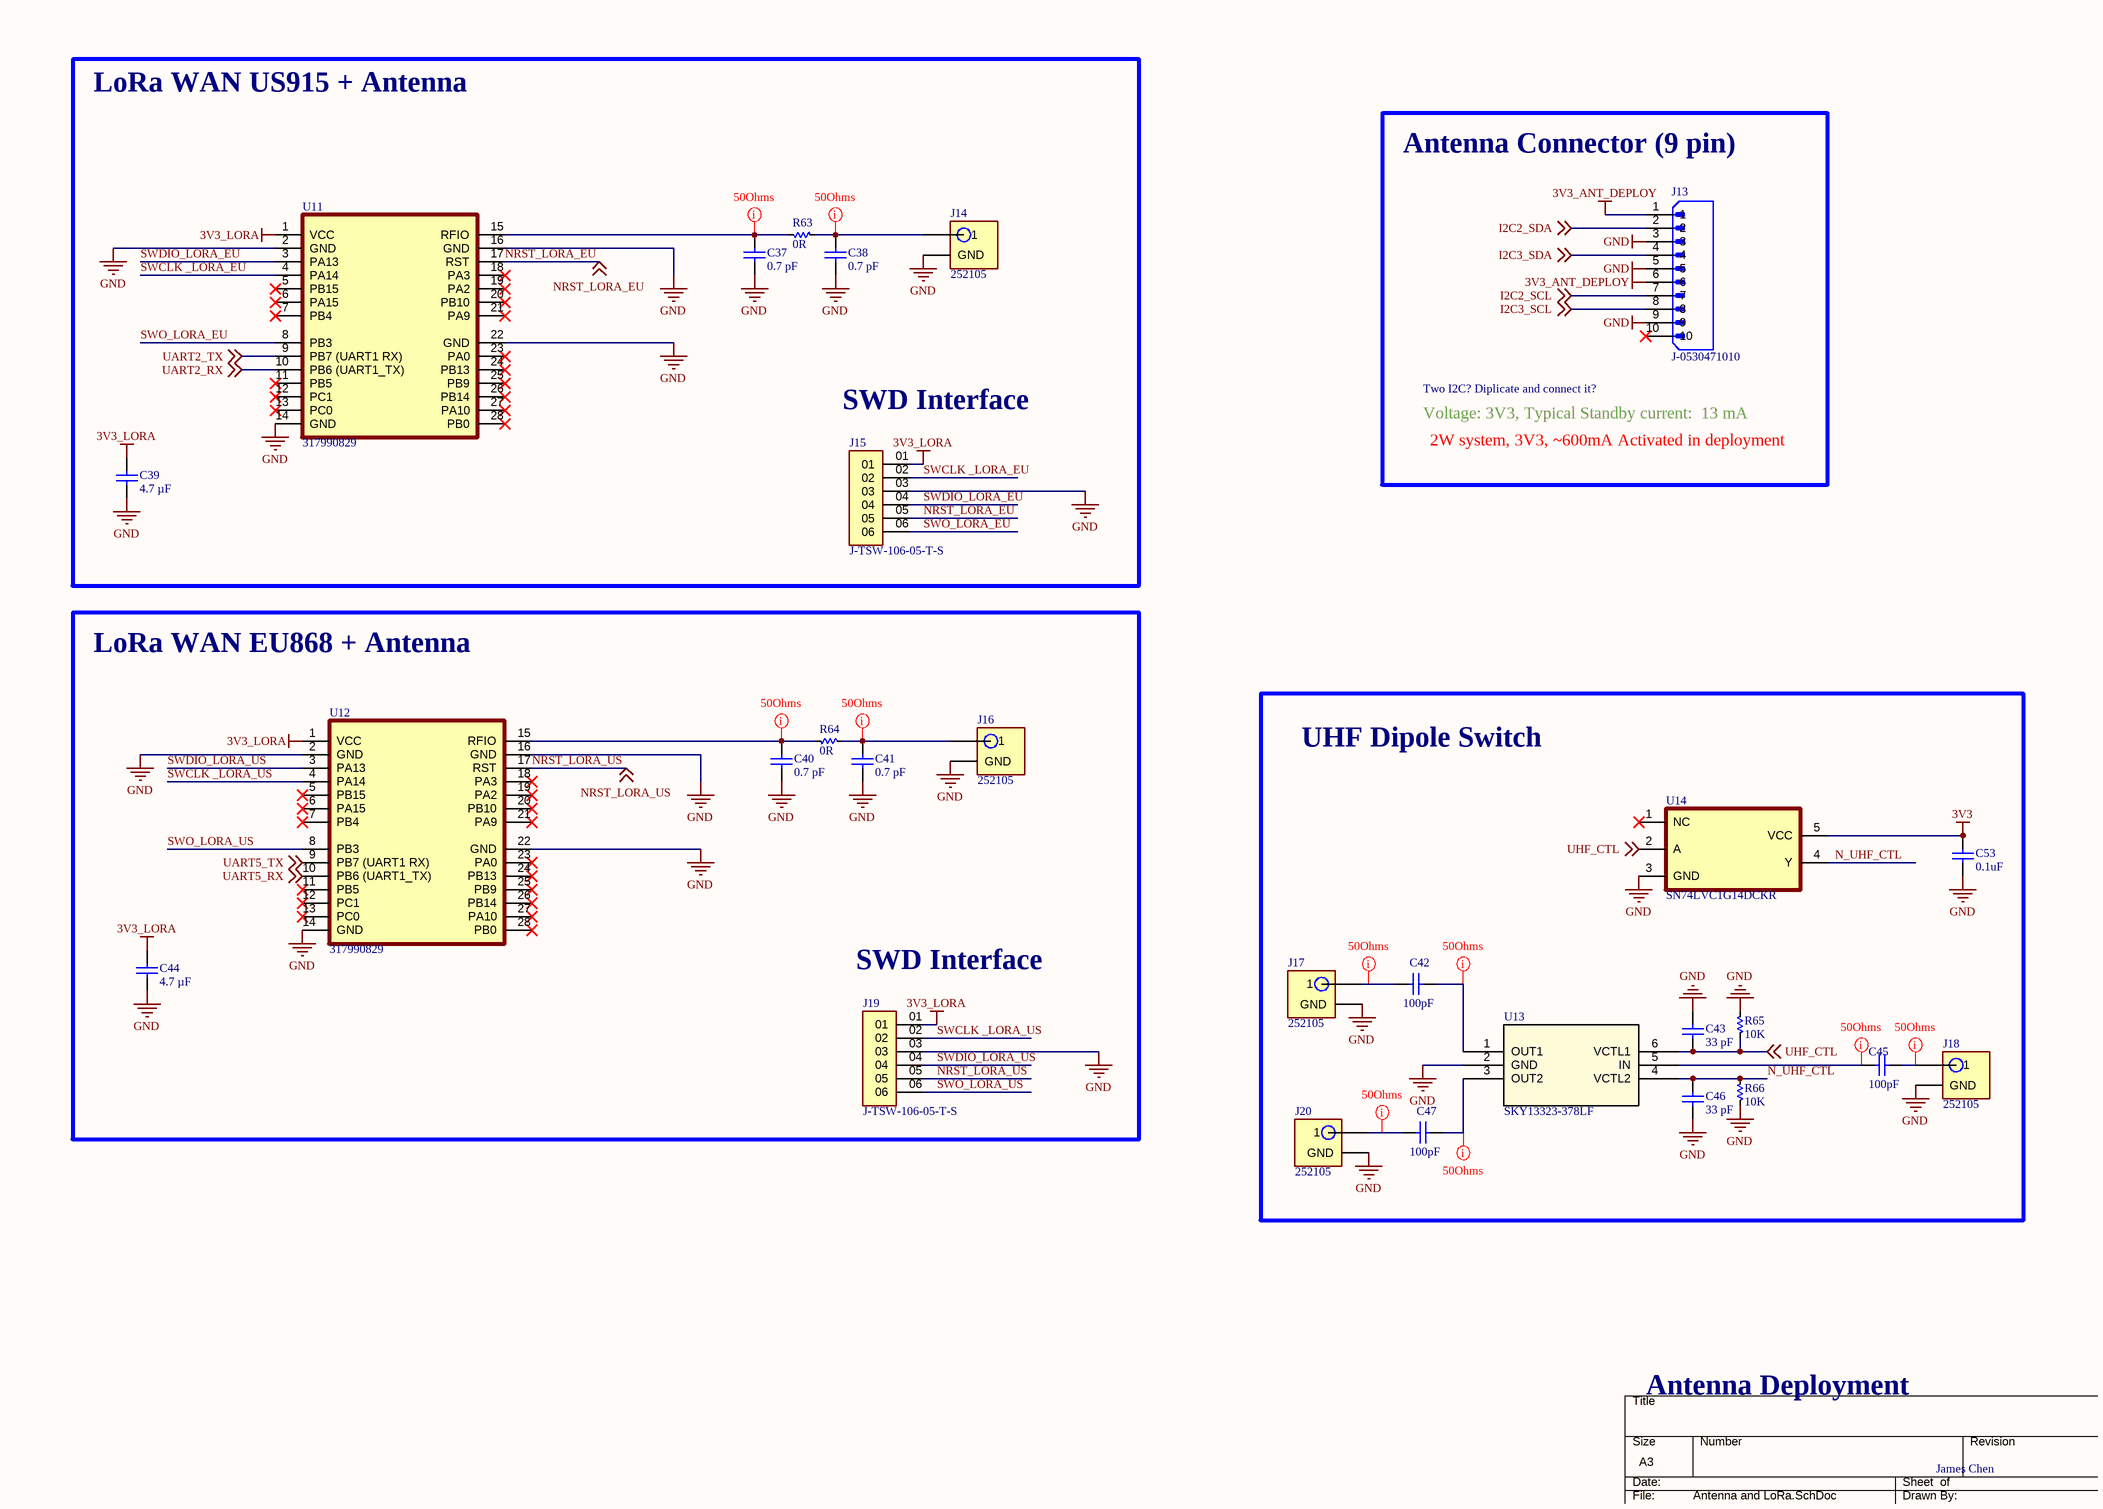
[diagram p3: Antenna and LoRa.SchDoc]

### Parts
C37  0.7 pF  [0603]
C38  0.7 pF  [0603]
C39  4.7 µF  [0603]
C40  0.7 pF  [0603]
C41  0.7 pF  [0603]
C42  100pF  [0603]
C43  33 pF  [0603]
C44  4.7 µF  [0603]
C45  100pF  [0603]
C46  33 pF  [0603]
C47  100pF  [0603]
C53  0.1uF  [0603]
J13  J-0530471010  [J-0530471010]
J14  252105  [J-252105]
J15  J-TSW-106-05-T-S  [J-TSW-106-05-T-S]
J16  252105  [J-252105]
J17  252105  [J-252105]
J18  252105  [J-252105]
J19  J-TSW-106-05-T-S  [J-TSW-106-05-T-S]
J20  252105  [J-252105]
R63  0R  [0603]
R64  0R  [0603]
R65  10K  [0603]
R66  10K  [0603]
U11  317990829  [U-LORA-E5]
U12  317990829  [U-LORA-E5]
U13  SKY13323-378LF  [U-SKY13323-378LF]
U14  SN74LVC1G14DCKR  [U-SN74LVC1G14DCKR]

### Blocks framed on the sheet
Antenna Connector (9 pin): J13
UHF Dipole Switch: C42 C43 C45-C47 C53 J17 J18 J20 R65 R66 U13 U14

### Nets
3V3: C53.2 U14.5(VCC)
3V3_ANT_DEPLOY: J13.1 J13.6
3V3_LORA: C39.2 C44.2 J15.01 J19.01 U11.1(VCC) U12.1(VCC)
GND: C37.1 C38.1 C39.1 C40.1 C41.1 C43.2 C44.1 C46.1 C53.1 J13.3 J13.5 J13.9 J14.0(GND) J15.03 J16.0(GND) J17.0(GND) J18.0(GND) J19.03 J20.0(GND) R65.2 R66.1 U11.2(GND) U11.14(GND) U11.16(GND) U11.22(GND) U12.2(GND) U12.14(GND) U12.16(GND) U12.22(GND) U13.2(GND) U14.3(GND)
I2C2_SCL: J13.7 ; off-sheet I2C2_SCL
I2C2_SDA: J13.2 ; off-sheet I2C2_SDA
I2C3_SCL: J13.8 ; off-sheet I2C3_SCL
I2C3_SDA: J13.4 ; off-sheet I2C3_SDA
N_UHF_CTL: C46.2 R66.2 U13.4(VCTL2) U14.4(Y)
NRST_LORA_EU: J15.05 U11.17(RST) ; off-sheet NRST_LORA_EU
NRST_LORA_US: J19.05 U12.17(RST) ; off-sheet NRST_LORA_US
SWCLK _LORA_EU: J15.02 U11.4(PA14)
SWCLK _LORA_US: J19.02 U12.4(PA14)
SWDIO_LORA_EU: J15.04 U11.3(PA13)
SWDIO_LORA_US: J19.04 U12.3(PA13)
SWO_LORA_EU: J15.06 U11.8(PB3)
SWO_LORA_US: J19.06 U12.8(PB3)
UART2_RX: U11.10(PB6_(UART1_TX)) ; off-sheet UART2_RX
UART2_TX: U11.9(PB7_(UART1_RX)) ; off-sheet UART2_TX
UART5_RX: U12.10(PB6_(UART1_TX)) ; off-sheet UART5_RX
UART5_TX: U12.9(PB7_(UART1_RX)) ; off-sheet UART5_TX
UHF_CTL: C43.1 R65.1 U13.6(VCTL1) U14.2(A) ; off-sheet UHF_CTL
NetC37_2: C37.2 R63.1 U11.15(RFIO)
NetC38_2: C38.2 J14.1 R63.2
NetC40_2: C40.2 R64.1 U12.15(RFIO)
NetC41_2: C41.2 J16.1 R64.2
NetC42_1: C42.1 J17.1
NetC42_2: C42.2 U13.1(OUT1)
NetC45_1: C45.1 U13.5(IN)
NetC45_2: C45.2 J18.1
NetC47_1: C47.1 J20.1
NetC47_2: C47.2 U13.3(OUT2)

Not connected (* = marked no-connect by the designer): J13 10*; U11 5(PB15)* 6(PA15)* 7(PB4)* 11(PB5)* 12(PC1)* 13(PC0)* 18(PA3)* 19(PA2)* 20(PB10)* 21(PA9)* 23(PA0)* 24(PB13)* 25(PB9)* 26(PB14)* 27(PA10)* 28(PB0)*; U12 5(PB15)* 6(PA15)* 7(PB4)* 11(PB5)* 12(PC1)* 13(PC0)* 18(PA3)* 19(PA2)* 20(PB10)* 21(PA9)* 23(PA0)* 24(PB13)* 25(PB9)* 26(PB14)* 27(PA10)* 28(PB0)*; U14 1(NC)*

### Layout directives
net class 50Ohms: NetC37_2, NetC38_2, NetC40_2, NetC41_2, NetC42_1, NetC42_2, NetC45_1, NetC45_2, NetC47_1, NetC47_2

### Notes on the sheet
- LoRa WAN US915 + Antenna
- (near J15) SWD Interface
- Voltage: 3V3, Typical Standby current:  13 mA
- Two I2C? Diplicate and connect it?
- 2W system, 3V3, ~600mA Activated in deployment
- LoRa WAN EU868 + Antenna
- (near J19) SWD Interface
- Antenna Deployment
- James Chen
- THIS DOCUMENT AND THE DATA DISCLOSED HEREIN OR
- HEREWITH IS THE PROPERTY OF ALTIUM LIMITED AND MAY
- DWG NO:
- REVISION
- REV:
- DESCRIPTION
- DATE
- APPROVED
- BE FREELY DISTRIBUTED IN WHOLE. NO RIGHTS ARE
- RESERVED OR EXPRESS OR IMPLIED WARANTEE GIVEN.
- ENG:
- APPROVALS
- PROJECT
- DSN:
- CHK:
- REFERENCE DOCUMENTS
- PROJECT REVISION:
- TITLE
- DOCUMENT REVISION:
- DESIGN ITEM:
- BOM:
- FAB DWG:
- PCB DWG:
- ASSY DWG:
- SCALE:
- A3
- SIZE
- CAGE CODE
- FILE NAME
- DWG NO.
- SHEET
- OF
- REV

### Library data of the parts
C37 C38 C40 C41 = CC-710-K-50V-X7R-0603: CAP CER 0.7PF 50V NP0 0603; Manufacturer: KEMET; Manufacturer Part #: CBR06C708B5GAC; ComponentLink1description: Datasheet; ComponentLink1URL: https://ds.yuden.co.jp/TYCOMPAS/ut/detail?pn=TMK105BJ104KV-F%20%20&u=M; ComponentLink2description: Manufacturer Website; Distributor: Digikey; Distributor Part #: 399-CBR06C708B5GACCT-ND; ComponentLink2URL: https://www.yuden.co.jp/or/; Value: 0.7 pF
C39 C44 = CC-105-K-25V-X7R-0603: CAP CER 4.7UF 16V X7R 0603; Manufacturer: Murata Electronics; Manufacturer Part #: GRM188Z71C475KE21J; Distributor: Digikey; Distributor Part #: 490-GRM188Z71C475KE21JCT-ND; Value: 4.7 µF
C42 C45 C47 = CC-104-K-25V-X5R-0402: CAP CER 100PF 50V X7R 0603; Manufacturer: YAGEO; Manufacturer Part #: CC0603KRX7R9BB101; ComponentLink1description: Datasheet; ComponentLink1URL: https://ds.yuden.co.jp/TYCOMPAS/ut/detail?pn=TMK105BJ104KV-F%20%20&u=M; ComponentLink2description: Manufacturer Website; Distributor: Digikey; Distributor Part #: 311-3601-1-ND; Part Description: CAP CER 100PF 50V X7R 0603; ComponentLink2URL: https://www.yuden.co.jp/or/; Value: 100pF
C43 C46 = CC-339-K-50V-X7R-0603: CAP CER 33PF 50V X7R 0603; Manufacturer: KEMET; Manufacturer Part #: C0603C330K5RAC7867; ComponentLink1description: Datasheet; ComponentLink1URL: https://ds.yuden.co.jp/TYCOMPAS/ut/detail?pn=TMK105BJ104KV-F%20%20&u=M; ComponentLink2description: Manufacturer Website; Distributor: Digikey; Distributor Part #: 399-C0603C330K5RAC7867CT-ND; Part Description: CAP CER 33PF 50V X7R 0603; ComponentLink2URL: https://www.yuden.co.jp/or/; Value: 33 pF
C53 = CC-104-K-25V-X7R-0603: as C1 on sheet STM32; ComponentLink1description: Datasheet; ComponentLink1URL: https://ds.yuden.co.jp/TYCOMPAS/ut/detail?pn=TMK105BJ104KV-F%20%20&u=M; ComponentLink2description: Manufacturer Website; Distributor: Digikey; Distributor Part #: 1276-1006-1-ND; Part Description: 0.1 µF ±10% 25V Ceramic Capacitor X7R 0603 (1608 Metric); ComponentLink2URL: https://www.yuden.co.jp/or/; Value: 0.1uF
J13 = J-0530471010: as J10 on sheet External Connectors; Manufacturer Part #: 0530471010; Distributor: Digikey; Distributor Part #: WM1739-ND
J14 J16-J18 J20 = J-252105: CONN MCX RCPT STR 50 OHM PCB; Manufacturer: Amphenol RF; Manufacturer Part #: 252105; Distributor Part #: ACX1262-ND; Distributor: Digikey
J15 J19 = J-TSW-106-05-T-S: as J1 on sheet STM32; Manufacturer Part #: TSW-106-05-T-S; Price: None
R63 R64 = RT-0R00-F-1/10W-0603: as R13 on sheet STM32; ComponentLink1description: Datasheet; ComponentLink1URL: https://industrial.panasonic.com/ww/products/resistors/chip-resistors/general-purpose-chip-resistors/models/ERJ2GE0R00X; ComponentLink2description: Manufacturer Website; Distributor: Digikey; Distributor Part #: RMCF0603ZT0R00CT-ND; Part Description: 0 Ohms Jumper 0.1W, 1/10W Chip Resistor 0603 (1608 Metric) Automotive AEC-Q200 Thick Film; ComponentLink2URL: https://industrial.panasonic.com/ww/products/resistors/chip-resistors/general-purpose-chip-resistors/models/ERJ2GE0R00X; Value: 0R
R65 R66 = RT-10K0-F-1/16W-0603: as R117 on sheet Memory; ComponentLink1description: Datasheet; ComponentLink1URL: https://www.vishay.com/docs/20035/dcrcwe3.pdf; ComponentLink2description: Manufacturer Website; Distributor: Digikey; Distributor Part #: A119886CT-ND; Part Description: 10 kOhms ±0.1% 0.063W, 1/16W Chip Resistor 0603 (1608 Metric) - Thin Film; ComponentLink2URL: https://www.vishay.com/; Value: 10K
U11 U12 = U-LORA-E5: LORA-E5 WIRELESS MODULE (TAPE RE; Manufacturer: Seeed Technology Co., Ltd; Manufacturer Part #: 317990829; Distributor: Digikey; Distributor Part #: 1597-317990829CT-ND
U13 = U-SKY13323-378LF: IC RF SWITCH SPDT 3GHZ 6MLPD; Manufacturer: Skyworks Solutions Inc.; Distrbutor Part #: 683-1334-1-ND; Manufacturer Part #: SKY13323-378LF; Distributor: Digikey
U14 = U-SN74LVC1G14DCKR: IC INVERT SCHMITT 1CH 1IN SC70; Manufactuer: Texas Instruments; Distributor: Digikey; Manufacturer Part Number: SN74LVC1G14DCKR; Distributor Part Number: 296-11608-1-ND

## Sheet Boom Deployment.SchDoc
size A3; SheetNumber: 5; SheetTotal: 5
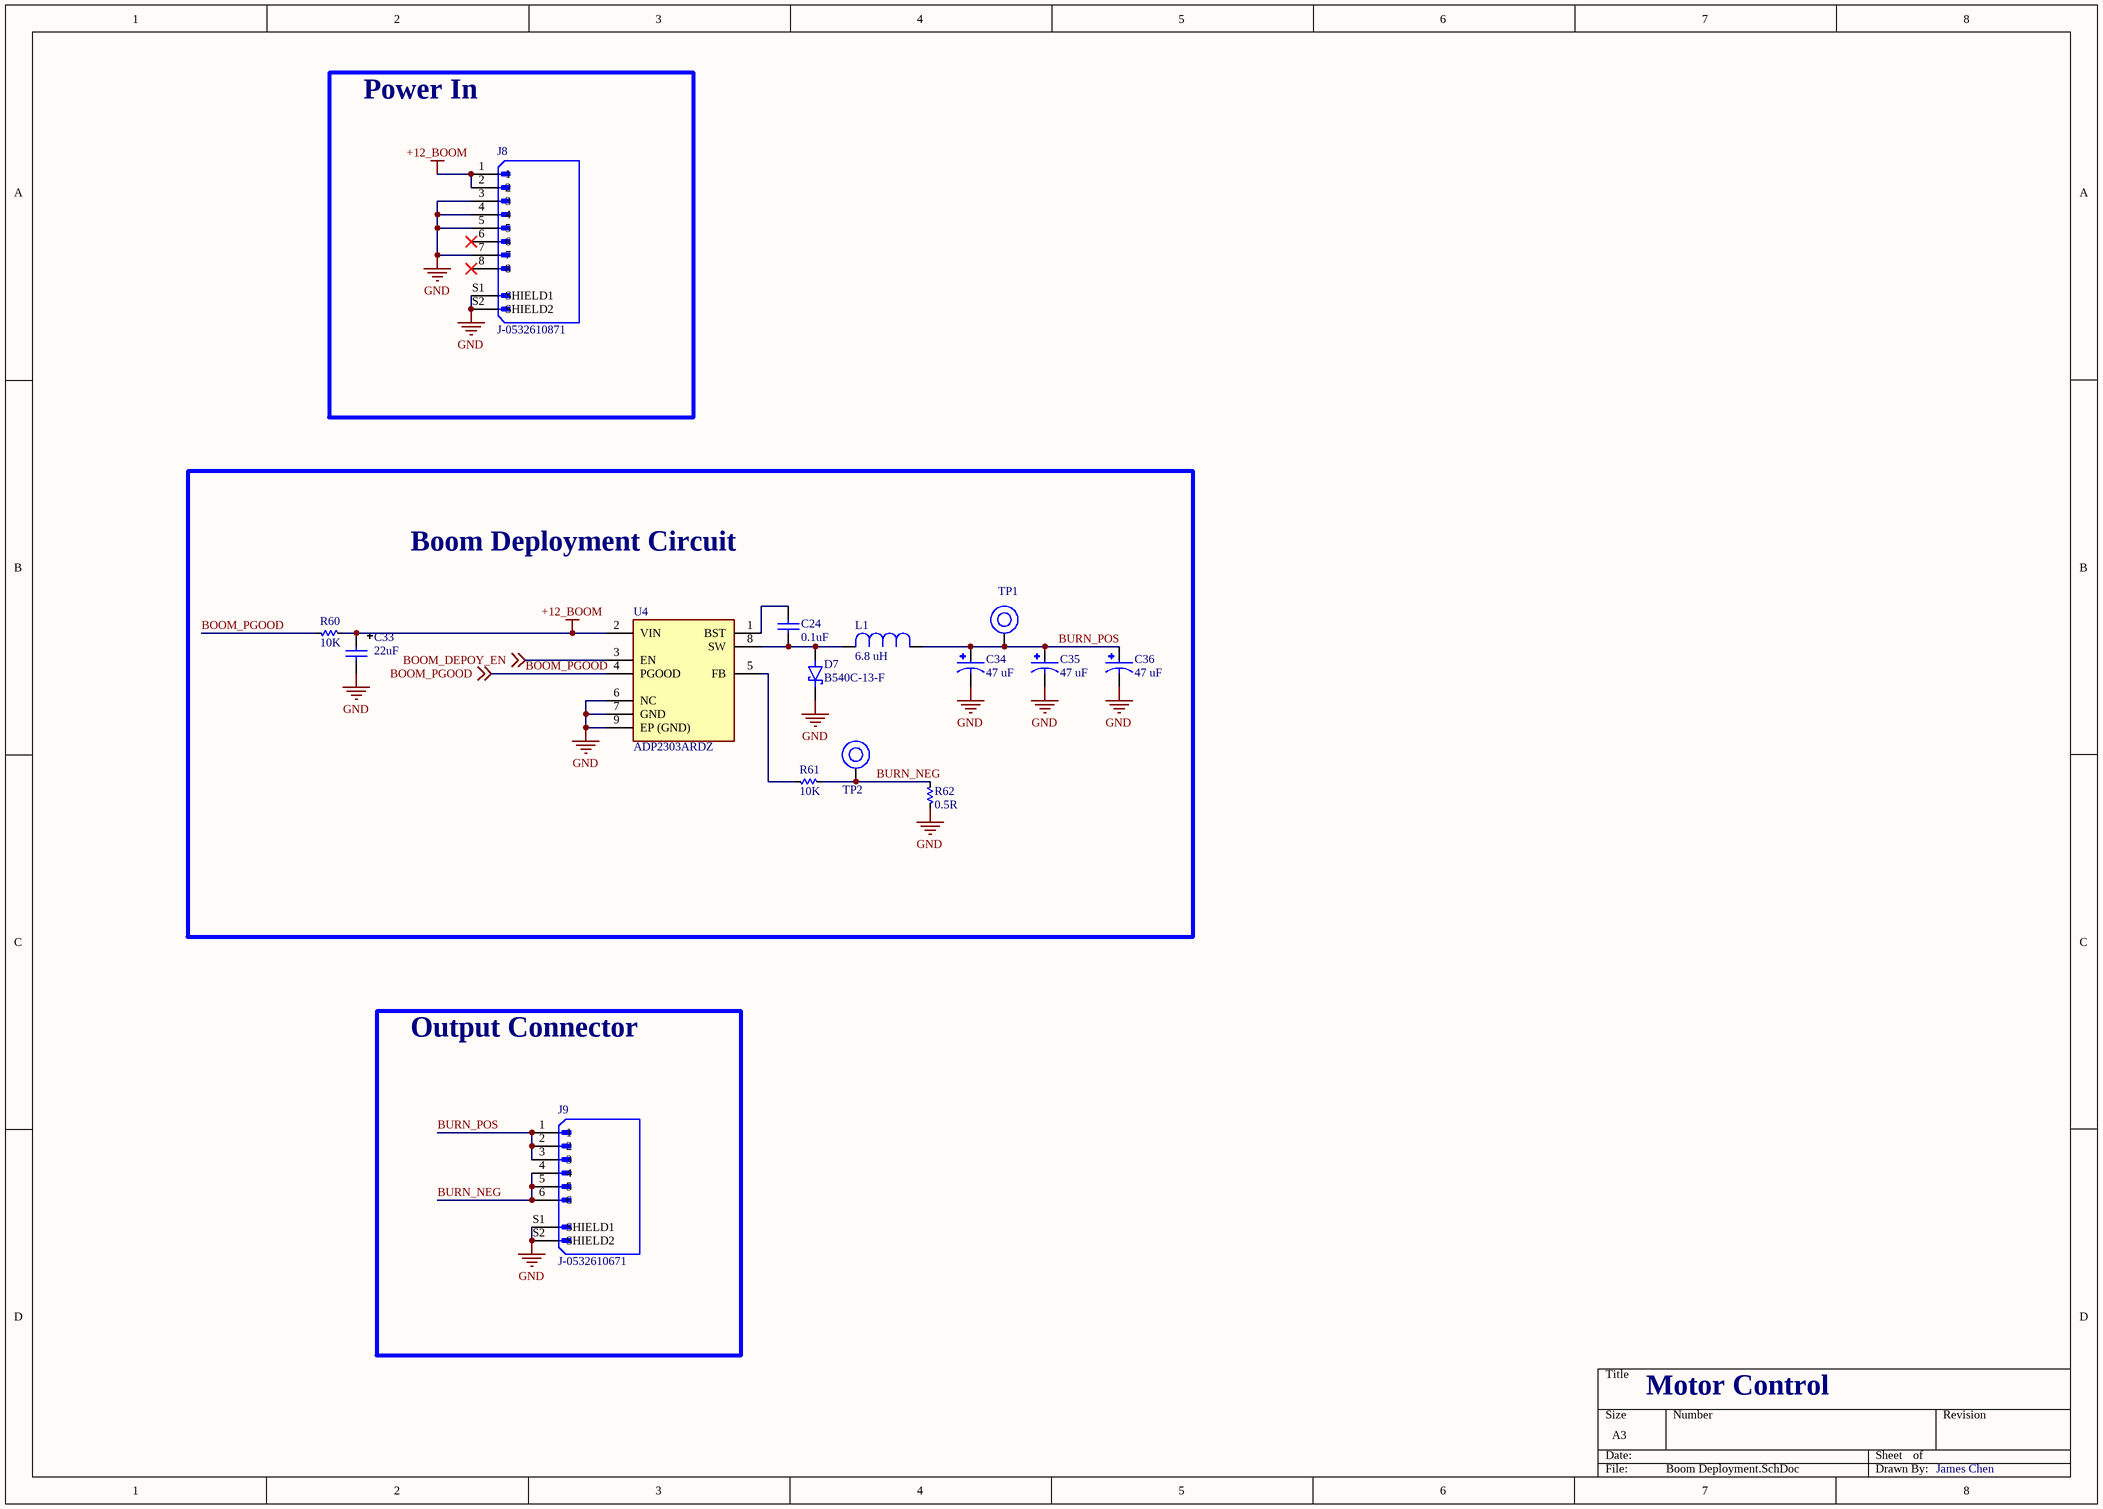
[diagram p4: Boom Deployment.SchDoc]

### Parts
C24  0.1uF  [0603]
C33  22uF  [CAP TANT 1206 (A) TCJ]
C34  47 uF  [CC-25SVPF47M]
C35  47 uF  [CC-25SVPF47M]
C36  47 uF  [CC-25SVPF47M]
D7  B540C-13-F  [D-B540C-13-F]
J8  J-0532610871  [J-532610871]
J9  J-0532610671  [J-0532610671]
L1  6.8 UH  [L-IHLP4040DZER6R8M01]
R60  10K  [0603]
R61  10K  [0603]
R62  0.5R  [2010]
TP1  TP  [TP]  (value not drawn)
TP2  TP  [TP]  (value not drawn)
U4  ADP2303ARDZ  [U-ADP2303ARDZ]

### Blocks framed on the sheet
Power In: J8
Boom Deployment Circuit: C24 C33-C36 D7 L1 R60-R62 TP1 TP2 U4
Output Connector: J9

### Nets
+12_BOOM: C33.1 J8.1 J8.2 R60.2 U4.2(VIN)
GND: C33.2 C34.2 C35.2 C36.2 D7.C(K) J8.3 J8.4 J8.5 J8.7 J8.S1(SHIELD1) J8.S2(SHIELD2) J9.S1(SHIELD1) J9.S2(SHIELD2) R62.1 U4.6(NC) U4.7(GND) U4.9(EP_(GND))
BOOM_DEPOY_EN: U4.3(EN) ; off-sheet BOOM_DEPOY_EN
BOOM_PGOOD: R60.1 U4.4(PGOOD) ; off-sheet BOOM_PGOOD
BURN_NEG: J9.4 J9.5 J9.6 R61.2 R62.2 TP2.1
BURN_POS: C34.1 C35.1 C36.1 J9.1 J9.2 J9.3 L1.1 TP1.1
NetC24_1: C24.1 D7.A L1.2 U4.8(SW)
NetC24_2: C24.2 U4.1(BST)
NetR61_1: R61.1 U4.5(FB)

Not connected (* = marked no-connect by the designer): J8 6* 8*

### Notes on the sheet
- Motor Control
- James Chen

### Library data of the parts
C24 = CC-104-K-25V-X7R-0603: as C1 on sheet STM32; ComponentLink1description: Datasheet; ComponentLink1URL: https://ds.yuden.co.jp/TYCOMPAS/ut/detail?pn=TMK105BJ104KV-F%20%20&u=M; ComponentLink2description: Manufacturer Website; Distributor: Digikey; Distributor Part #: 1276-1006-1-ND; Part Description: 0.1 µF ±10% 25V Ceramic Capacitor X7R 0603 (1608 Metric); ComponentLink2URL: https://www.yuden.co.jp/or/; Value: 0.1uF
C33 = CT-225-M-20V-OTH-1206: CAP TANT 22UF 10% 10V 1206; Manufacturer: KYOCERA AVX; Manufacturer Part #: TPSA226K010T0900; ComponentLink1Description: Datasheet; ComponentLink1URL: *; ComponentLink2Description: Manufacturer Website; ComponentLink2URL: *; Distributor: Digikey; Distributor Part #: 478-11193-1-ND; Part Description: CAP TANT 22UF 10% 10V 1206; Value: 22uF
C34-C36 = CC-25SVPF47M: CAP ALUM POLY 47UF 20% 25V SMD; Manufacturer: Panasonic Electronic Components; ComponentLink1Description: Datasheet; ComponentLink1URL: *; ComponentLink2Description: Manufacture Website; ComponentLink2URL: *; Distributor: Digikey; Distributor Part #: P16513CT-ND; Manufacturer Part #: 25SVPF47M; Part Description: CAP ALUM POLY 47UF 20% 25V SMD; Value: 47 uF
D7 = D-B540C-13-F: DIODE SCHOTTKY 40V 5A SMC; Manufacturer: Diodes Incorporated; Manufacturer Part #: B540C-13-F; Distributor Part #: B540C-FDICT-ND; Distributor: Digikey
J8 = J-0532610871: as J3 on sheet External Connectors; Manfacturer Part #: 0532610871; Distributor Part #: WM7626CT-ND; Distributor: Digi-Key
J9 = J-0532610671: as J7 on sheet External Connectors; Distributor: Digi-Key; Manfacturer Part #: 0532610671; Distributor Part #: WM7624CT-ND
L1 = L-IHLP4040DZER6R8M01: FIXED IND 6.8UH 8A 23.3 MOHM SMD; Manufacturer: Vishay Dale; Manufacturer Part #: IHLP4040DZER6R8M01; Distributor Part #: 541-1303-1-ND; Distributor: Digikey; Value: 6.8 uH
R60 R61 = RT-10K0-F-1/16W-0603: RES 10K OHM 1% 1/8W 0603; Manufacturer: Stackpole Electronics Inc; Manufacturer Part #: RNCP0603FTD10K0; ComponentLink1description: Datasheet; ComponentLink1URL: https://www.vishay.com/docs/20035/dcrcwe3.pdf; ComponentLink2description: Manufacturer Website; Distributor: Digikey; Distributor Part #: RNCP0603FTD10K0CT-ND; Part Description: RES 10K OHM 1% 1/8W 0603; ComponentLink2URL: https://www.vishay.com/; Value: 10K
R62 = RT-0.5R0-F-1W-2010: RES 0.5 OHM 1% 1W 2010; Manufacturer: Vishay Dale; Manufacturer Part #: WSLT2010R5000FEA18; ComponentLink1description: Datasheet; ComponentLink1URL: https://www.vishay.com/docs/20035/dcrcwe3.pdf; ComponentLink2description: Manufacturer Website; Distributor: Digikey; Distributor Part #: 541-10112-1-ND; Part Description: RES 0.5 OHM 1% 1W 2010; ComponentLink2URL: https://www.vishay.com/; Value: 0.5R
TP1 TP2 = TP: Test Point; ComponentLink1description: Datasheet; ComponentLink1URL: https://industrial.panasonic.com/ww/products/resistors/chip-resistors/general-purpose-chip-resistors/models/ERJ2GE0R00X; ComponentLink2description: Manufacturer Website; ComponentLink2URL: https://industrial.panasonic.com/ww/products/resistors/chip-resistors/general-purpose-chip-resistors/models/ERJ2GE0R00X
U4 = U-ADP2303ARDZ: IC REG BUCK ADJUSTABLE 3A 8SOIC; Manufacturer: Analog Devices Inc.; Manufacturer Part #: ADP2303ARDZ; Distributor: Digikey; Distributor Part #: 505-ADP2303ARDZ-ND

## Nets that join several sheets
3V3: STM32 (45 pins), Memory (22 pins), External Connectors (8 pins), Antenna and LoRa (C53.2 U14.5)
3V3_ANT_DEPLOY: External Connectors (C49.1 J6.50), Antenna and LoRa (J13.1 J13.6)
3V3_LORA: External Connectors (C50.1 J6.52), Antenna and LoRa (6 pins)
GND: STM32 (45 pins), Memory (12 pins), External Connectors (41 pins), Antenna and LoRa (31 pins), Boom Deployment (17 pins)
BOOM_DEPOY_EN: STM32 (R37.2), Boom Deployment (U4.3)
BOOM_PGOOD: STM32 (R39.1), Boom Deployment (R60.1 U4.4)
CAM_EN: STM32 (R31.1), External Connectors (J7.2)
GPS_PPS: STM32 (R30.2), External Connectors (J3.7)
I2C1_SCL: STM32 (R91.1 U1.129), External Connectors (J6.43 R53.1)
I2C1_SDA: STM32 (R92.2 U1.128), External Connectors (J6.41 R55.1)
I2C2_SCL: STM32 (R19.2 U1.11), Antenna and LoRa (J13.7)
I2C2_SDA: STM32 (R20.2 U1.10), Antenna and LoRa (J13.2)
I2C3_SCL: STM32 (R54.2 U1.92), Antenna and LoRa (J13.8)
I2C3_SDA: STM32 (R49.2 U1.93), Antenna and LoRa (J13.4)
LPUART1_RX: STM32 (R18.1), External Connectors (R42.1)
LPUART1_TX: STM32 (R21.1), External Connectors (R44.1)
MPI_RX_NEN: STM32 (R46.2), External Connectors (U9.3)
MPI_TX_EN: STM32 (R43.2), External Connectors (U9.4)
NRST: STM32 (C19.2 J1.06 J2.05 U1.25), External Connectors (R52.1)
NRST_LORA_EU: STM32 (R23.2), Antenna and LoRa (J15.05 U11.17)
NRST_LORA_US: STM32 (R57.2), Antenna and LoRa (J19.05 U12.17)
SPI1_MISO: STM32 (R10.1), Memory (6 pins), External Connectors (R34.2)
SPI1_MOSI: STM32 (R9.1), Memory (6 pins), External Connectors (R36.2)
SPI1_SCLK: STM32 (R12.1), Memory (6 pins), External Connectors (R32.1)
SPI_NCS_FLASH_0: STM32 (R26.2), Memory (R117.2 U2.7)
SPI_NCS_FLASH_1: STM32 (R27.2), Memory (R119.2 U2.6)
SPI_NCS_FLASH_2: STM32 (R28.2), Memory (R120.1 U3.6)
SPI_NCS_FLASH_3: STM32 (R17.2), Memory (R118.2 U3.7)
SPI_NCS_FLASH_4: STM32 (R16.2), Memory (R127.1 U6.6)
SPI_NCS_FLASH_5: STM32 (R15.2), Memory (R126.2 U6.7)
SPI_NCS_FLASH_6: STM32 (R14.2), Memory (R125.1 U5.6)
SPI_NCS_FLASH_7: STM32 (R13.2), Memory (R124.2 U5.7)
SPI_NCS_FRAM_0: STM32 (R22.2), Memory (R129.2 U8.1)
SPI_NCS_FRAM_1: STM32 (R24.2), Memory (R128.2 U7.1)
SWCLK: STM32 (J2.02 U1.109), External Connectors (R47.1)
SWDIO: STM32 (J2.04 U1.105), External Connectors (R45.1)
SWO: STM32 (J2.06 U1.133), External Connectors (R51.1)
UART2_RX: STM32 (R59.2), Antenna and LoRa (U11.10)
UART2_TX: STM32 (R58.2), Antenna and LoRa (U11.9)
UART4_RX: STM32 (R29.1), External Connectors (J7.4)
UART4_TX: STM32 (R25.1), External Connectors (J7.3)
UART5_RX: STM32 (R56.2), Antenna and LoRa (U12.10)
UART5_TX: STM32 (R40.2), Antenna and LoRa (U12.9)
UHF_CTL: STM32 (R67.1), Antenna and LoRa (C43.1 R65.1 U13.6 U14.2)
USART1_RX: STM32 (R109.2), External Connectors (R33.1 U9.5)
USART1_TX: STM32 (R107.2), External Connectors (R35.1 U9.2)
USART3_RX: STM32 (R48.1), External Connectors (J3.4)
USART3_TX: STM32 (R50.1), External Connectors (J3.3)

## Assembly variants
Build: not fitted C37 C38 C40 C41 J1 J2 J15 J19